# EasyEDA Pro project 数电课设-电子密码锁.eprj

# Schematic 密码电子锁

## Sheets
1 按键输入模块: Create Date: 2022-10-20; Page Name: 按键输入模块; Project Name: 数电课设-电子密码锁; Schematic Name: 密码电子锁; Update Date: 2022-10-27; Company: 广东工业大学; Drawed: 陈宇杰; Page Size: A4; Version: V1.0
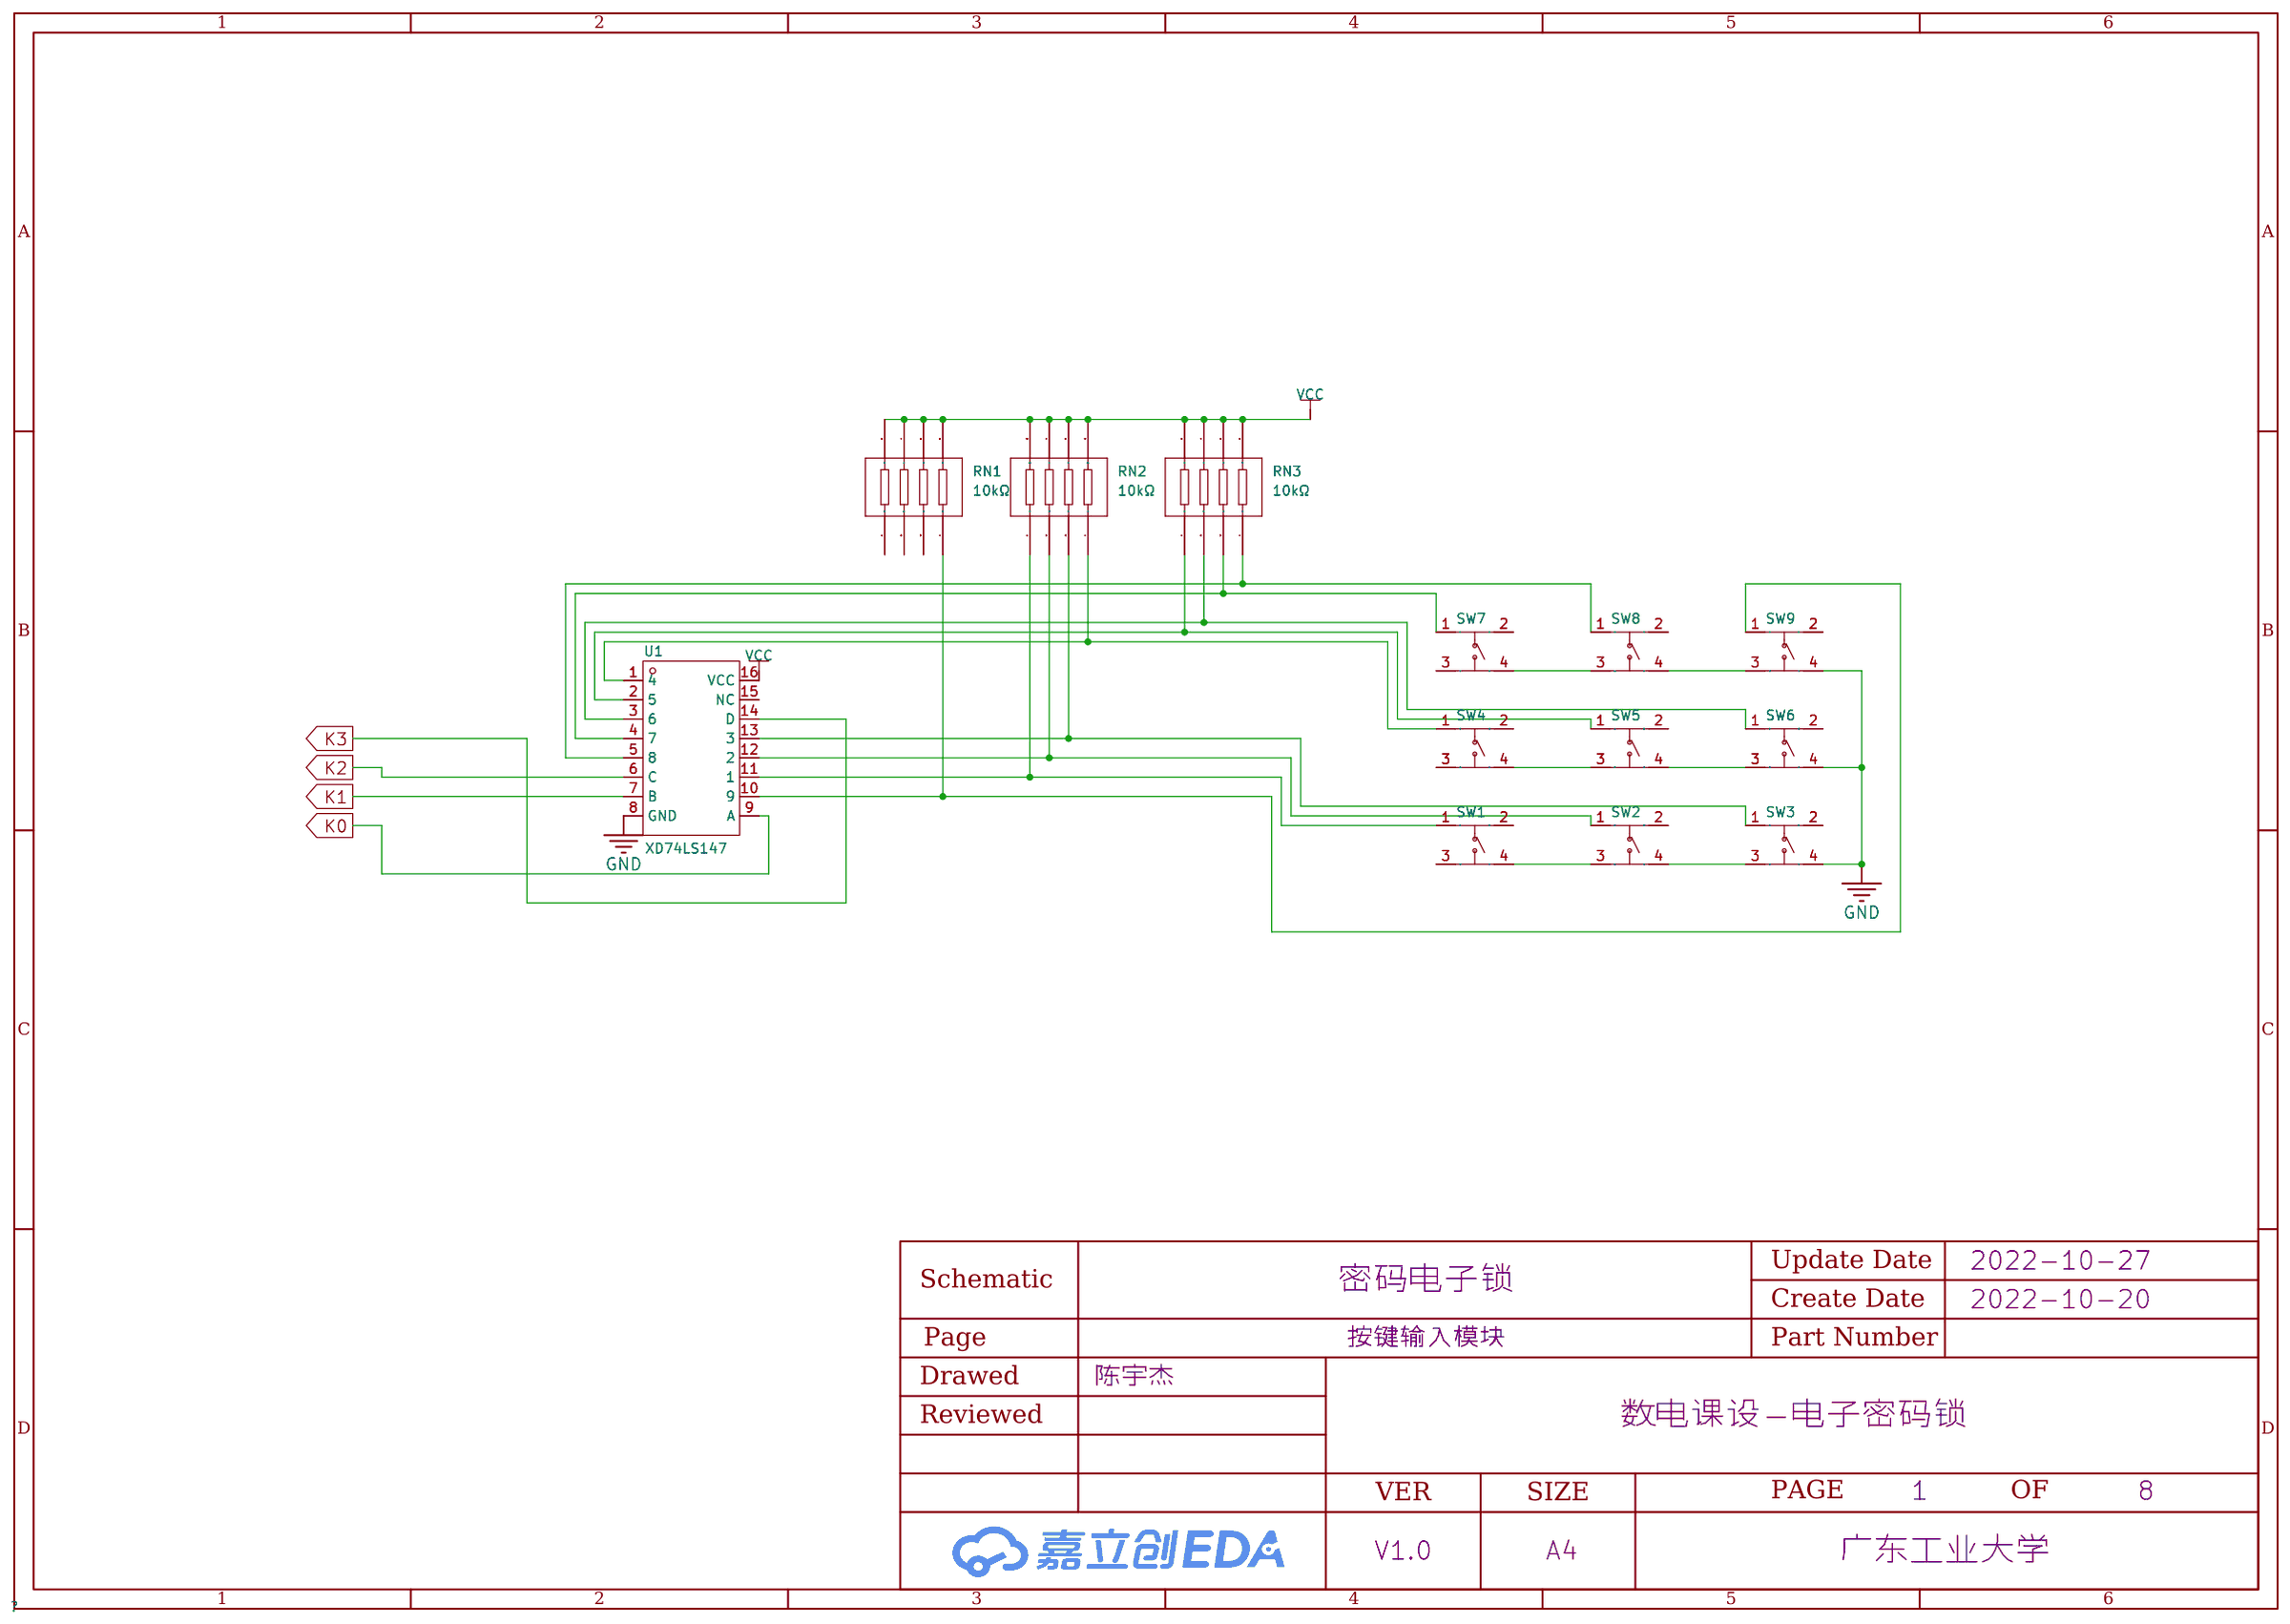
[diagram p0: 按键输入模块]
2 模式选择模块: Page Name: 模式选择模块; Update Date: 2022-10-21
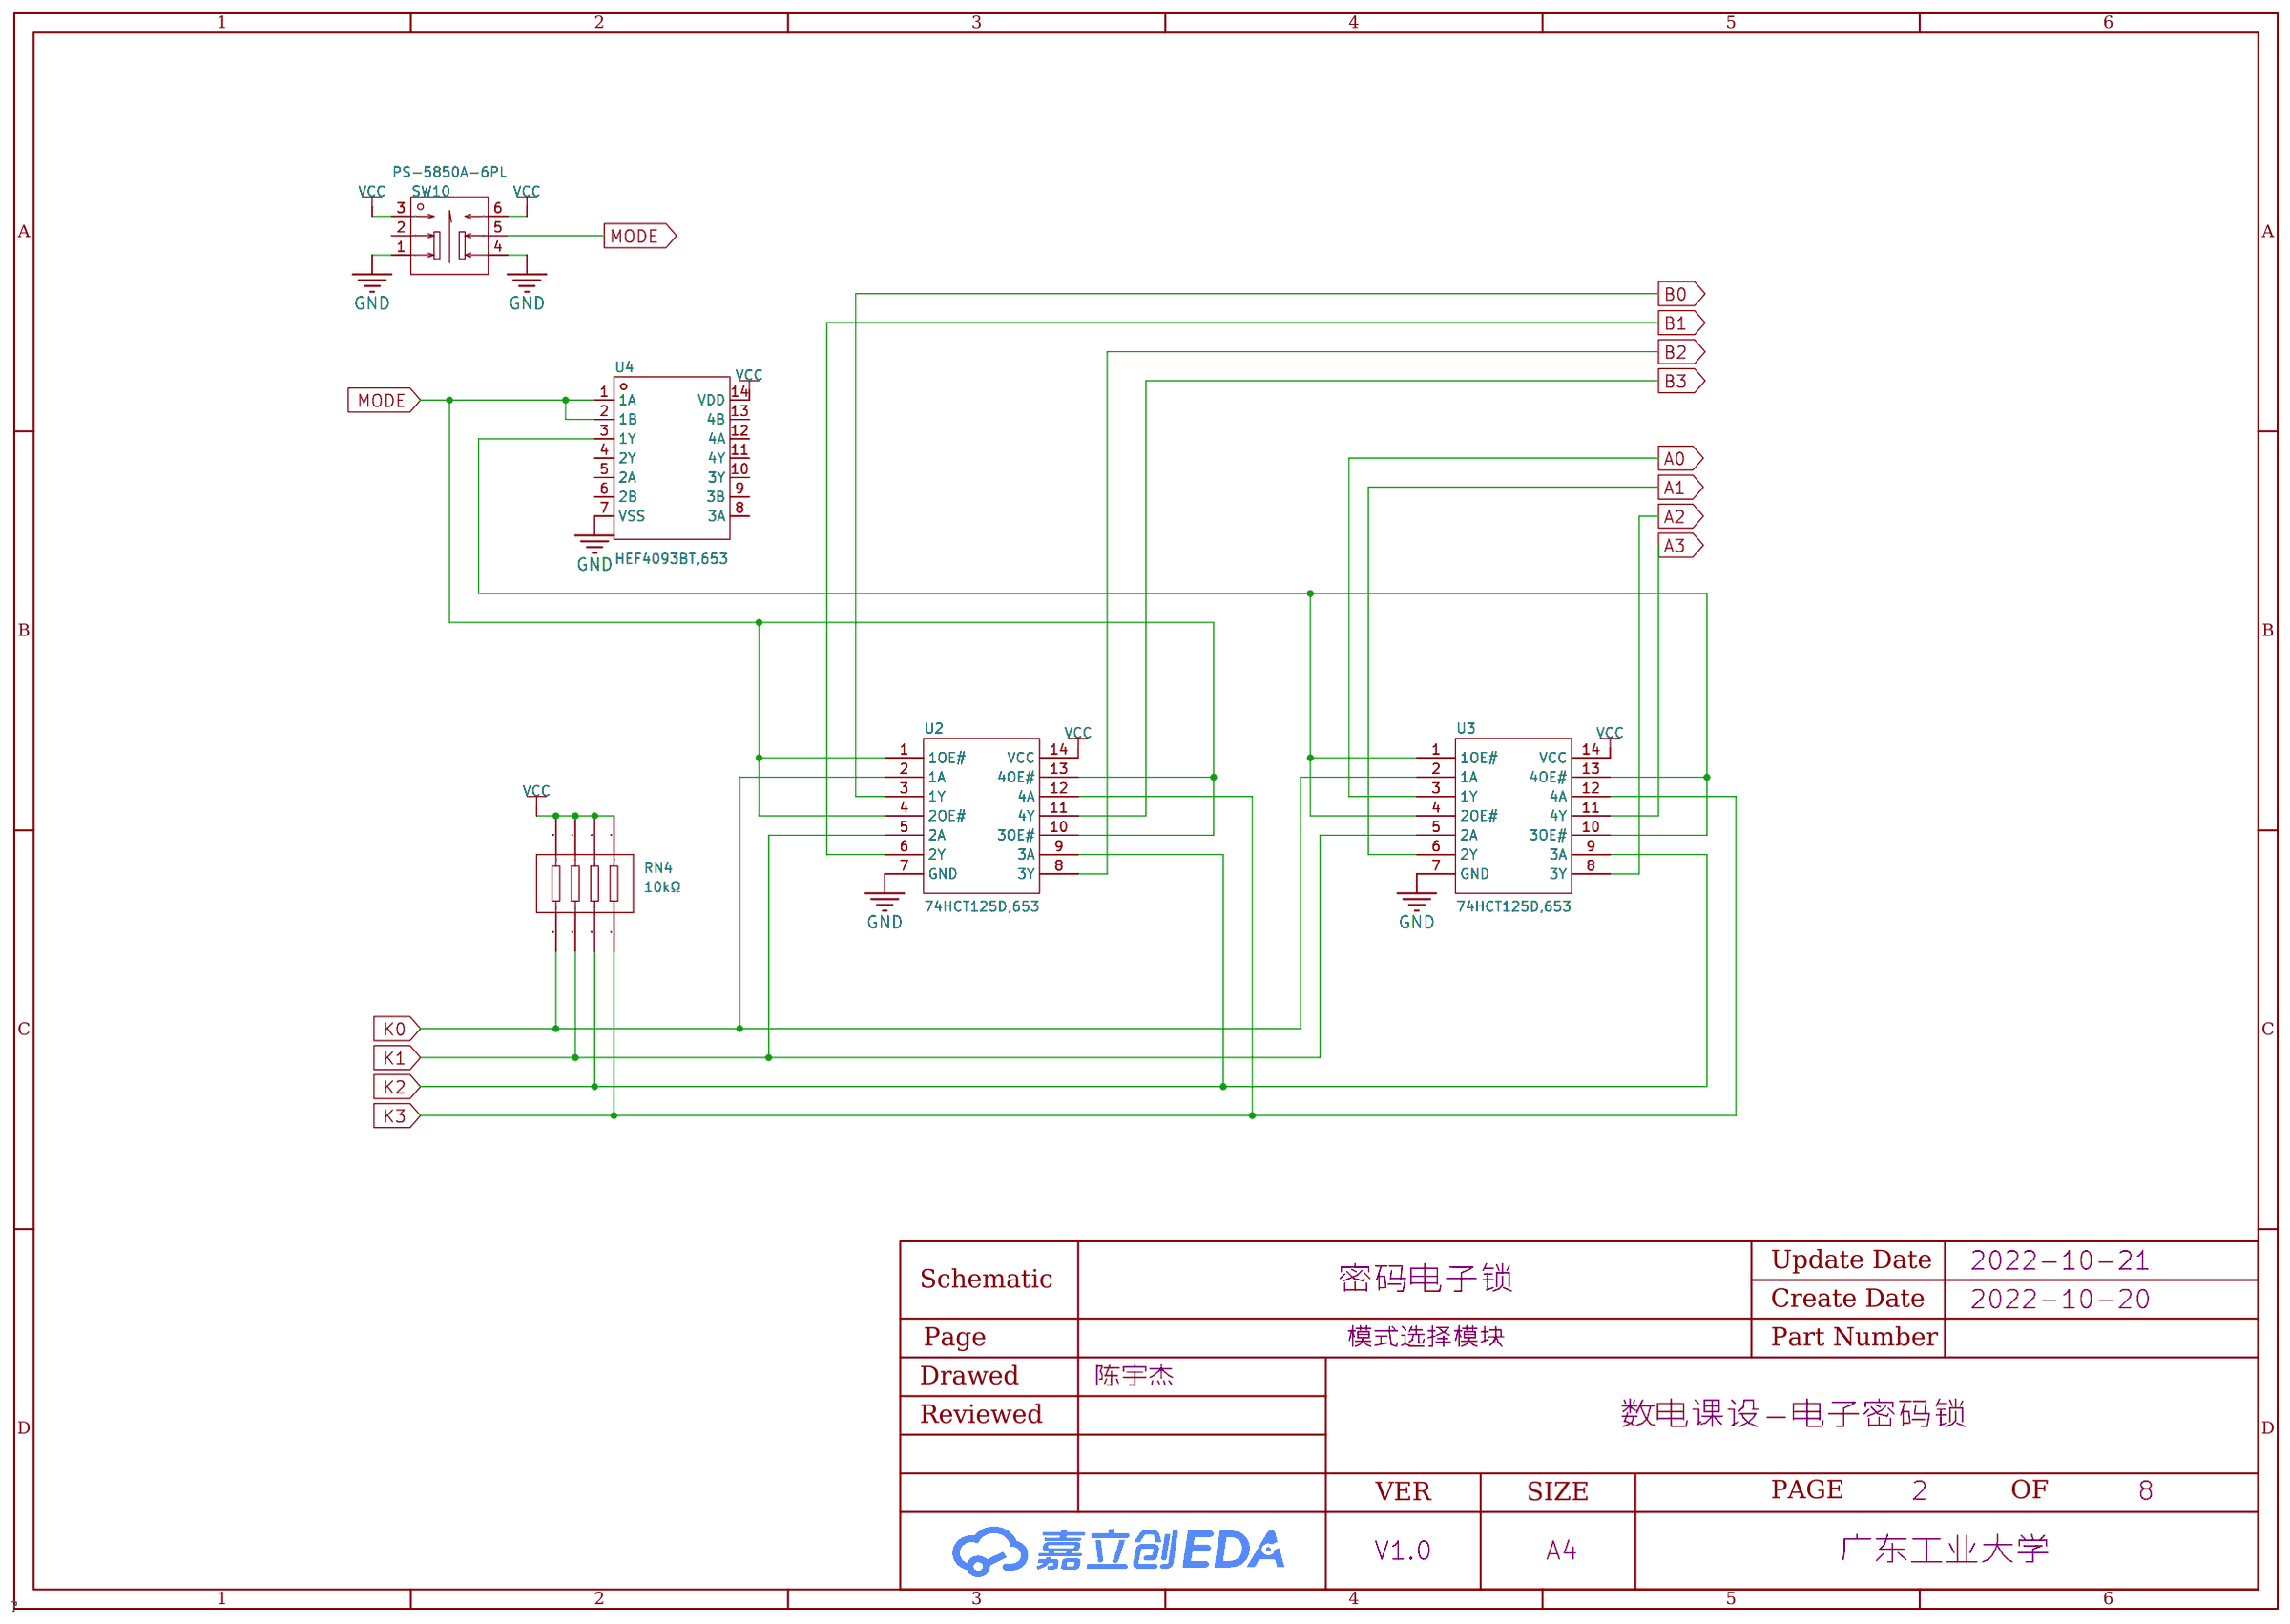
[diagram p1: 模式选择模块]
3 密码保存模块: Page Name: 密码保存模块; Update Date: 2022-10-21
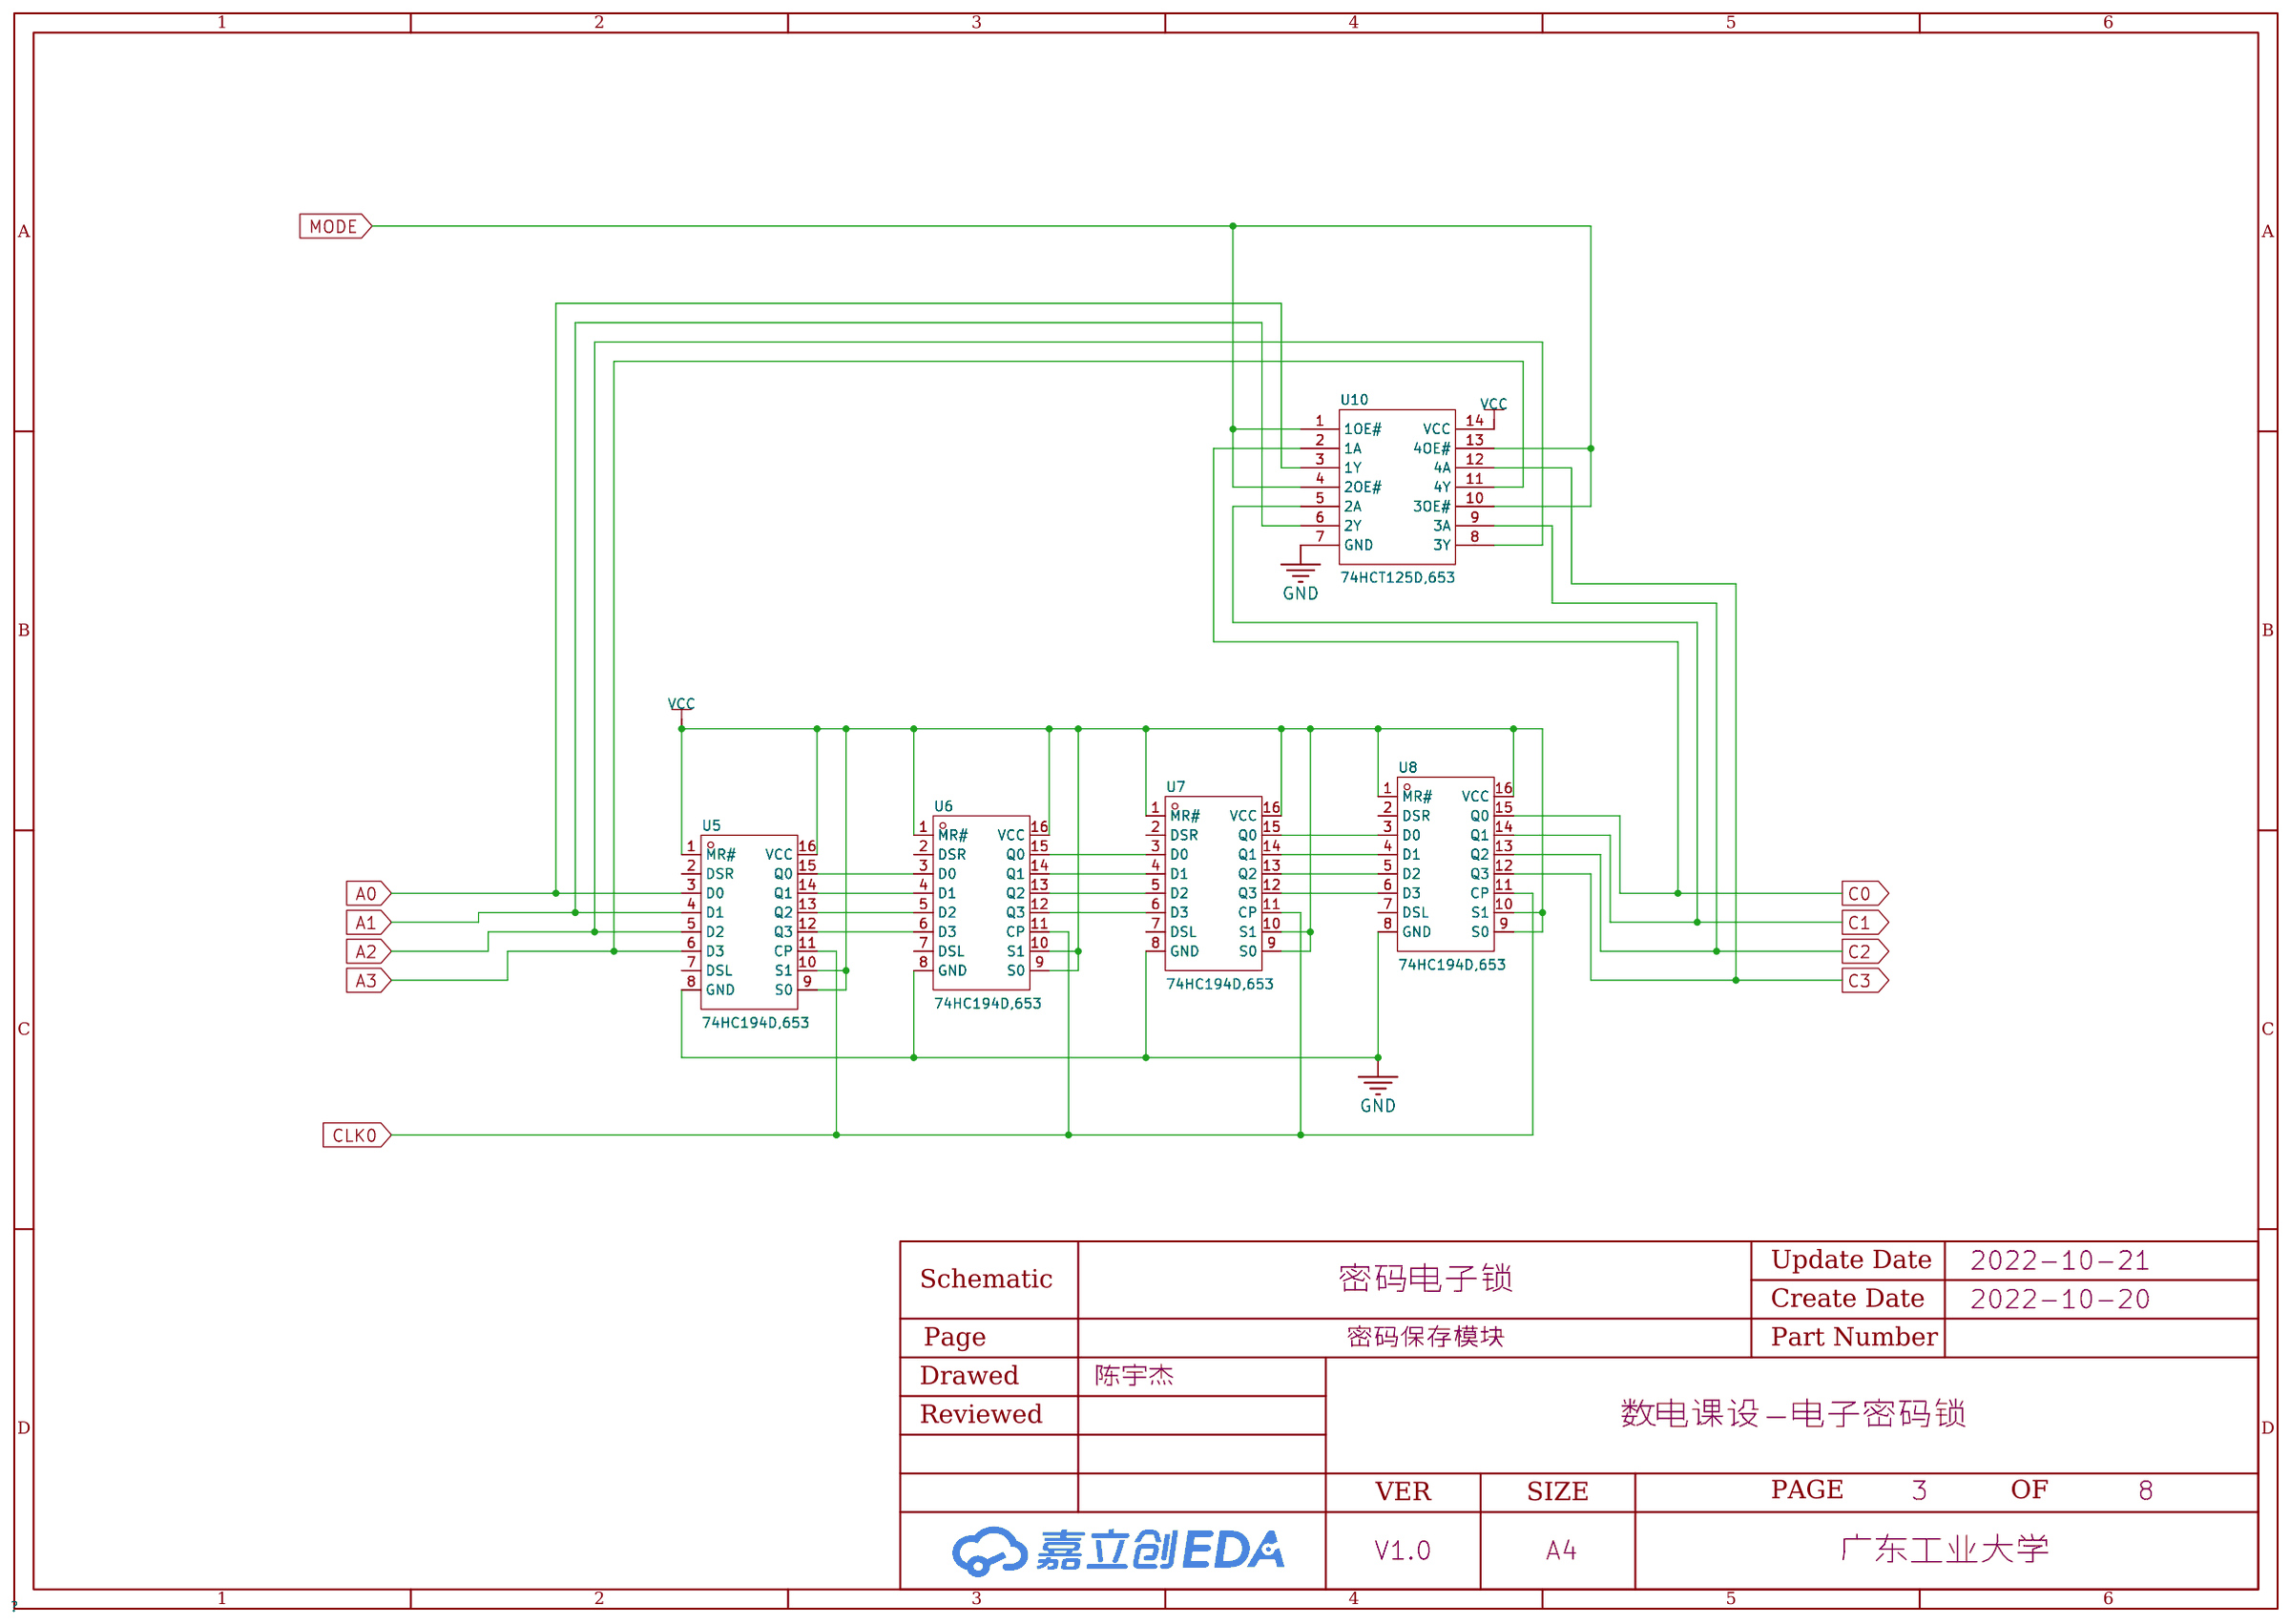
[diagram p2: 密码保存模块]
4 数字比较模块: Page Name: 数字比较模块; Update Date: 2022-10-21
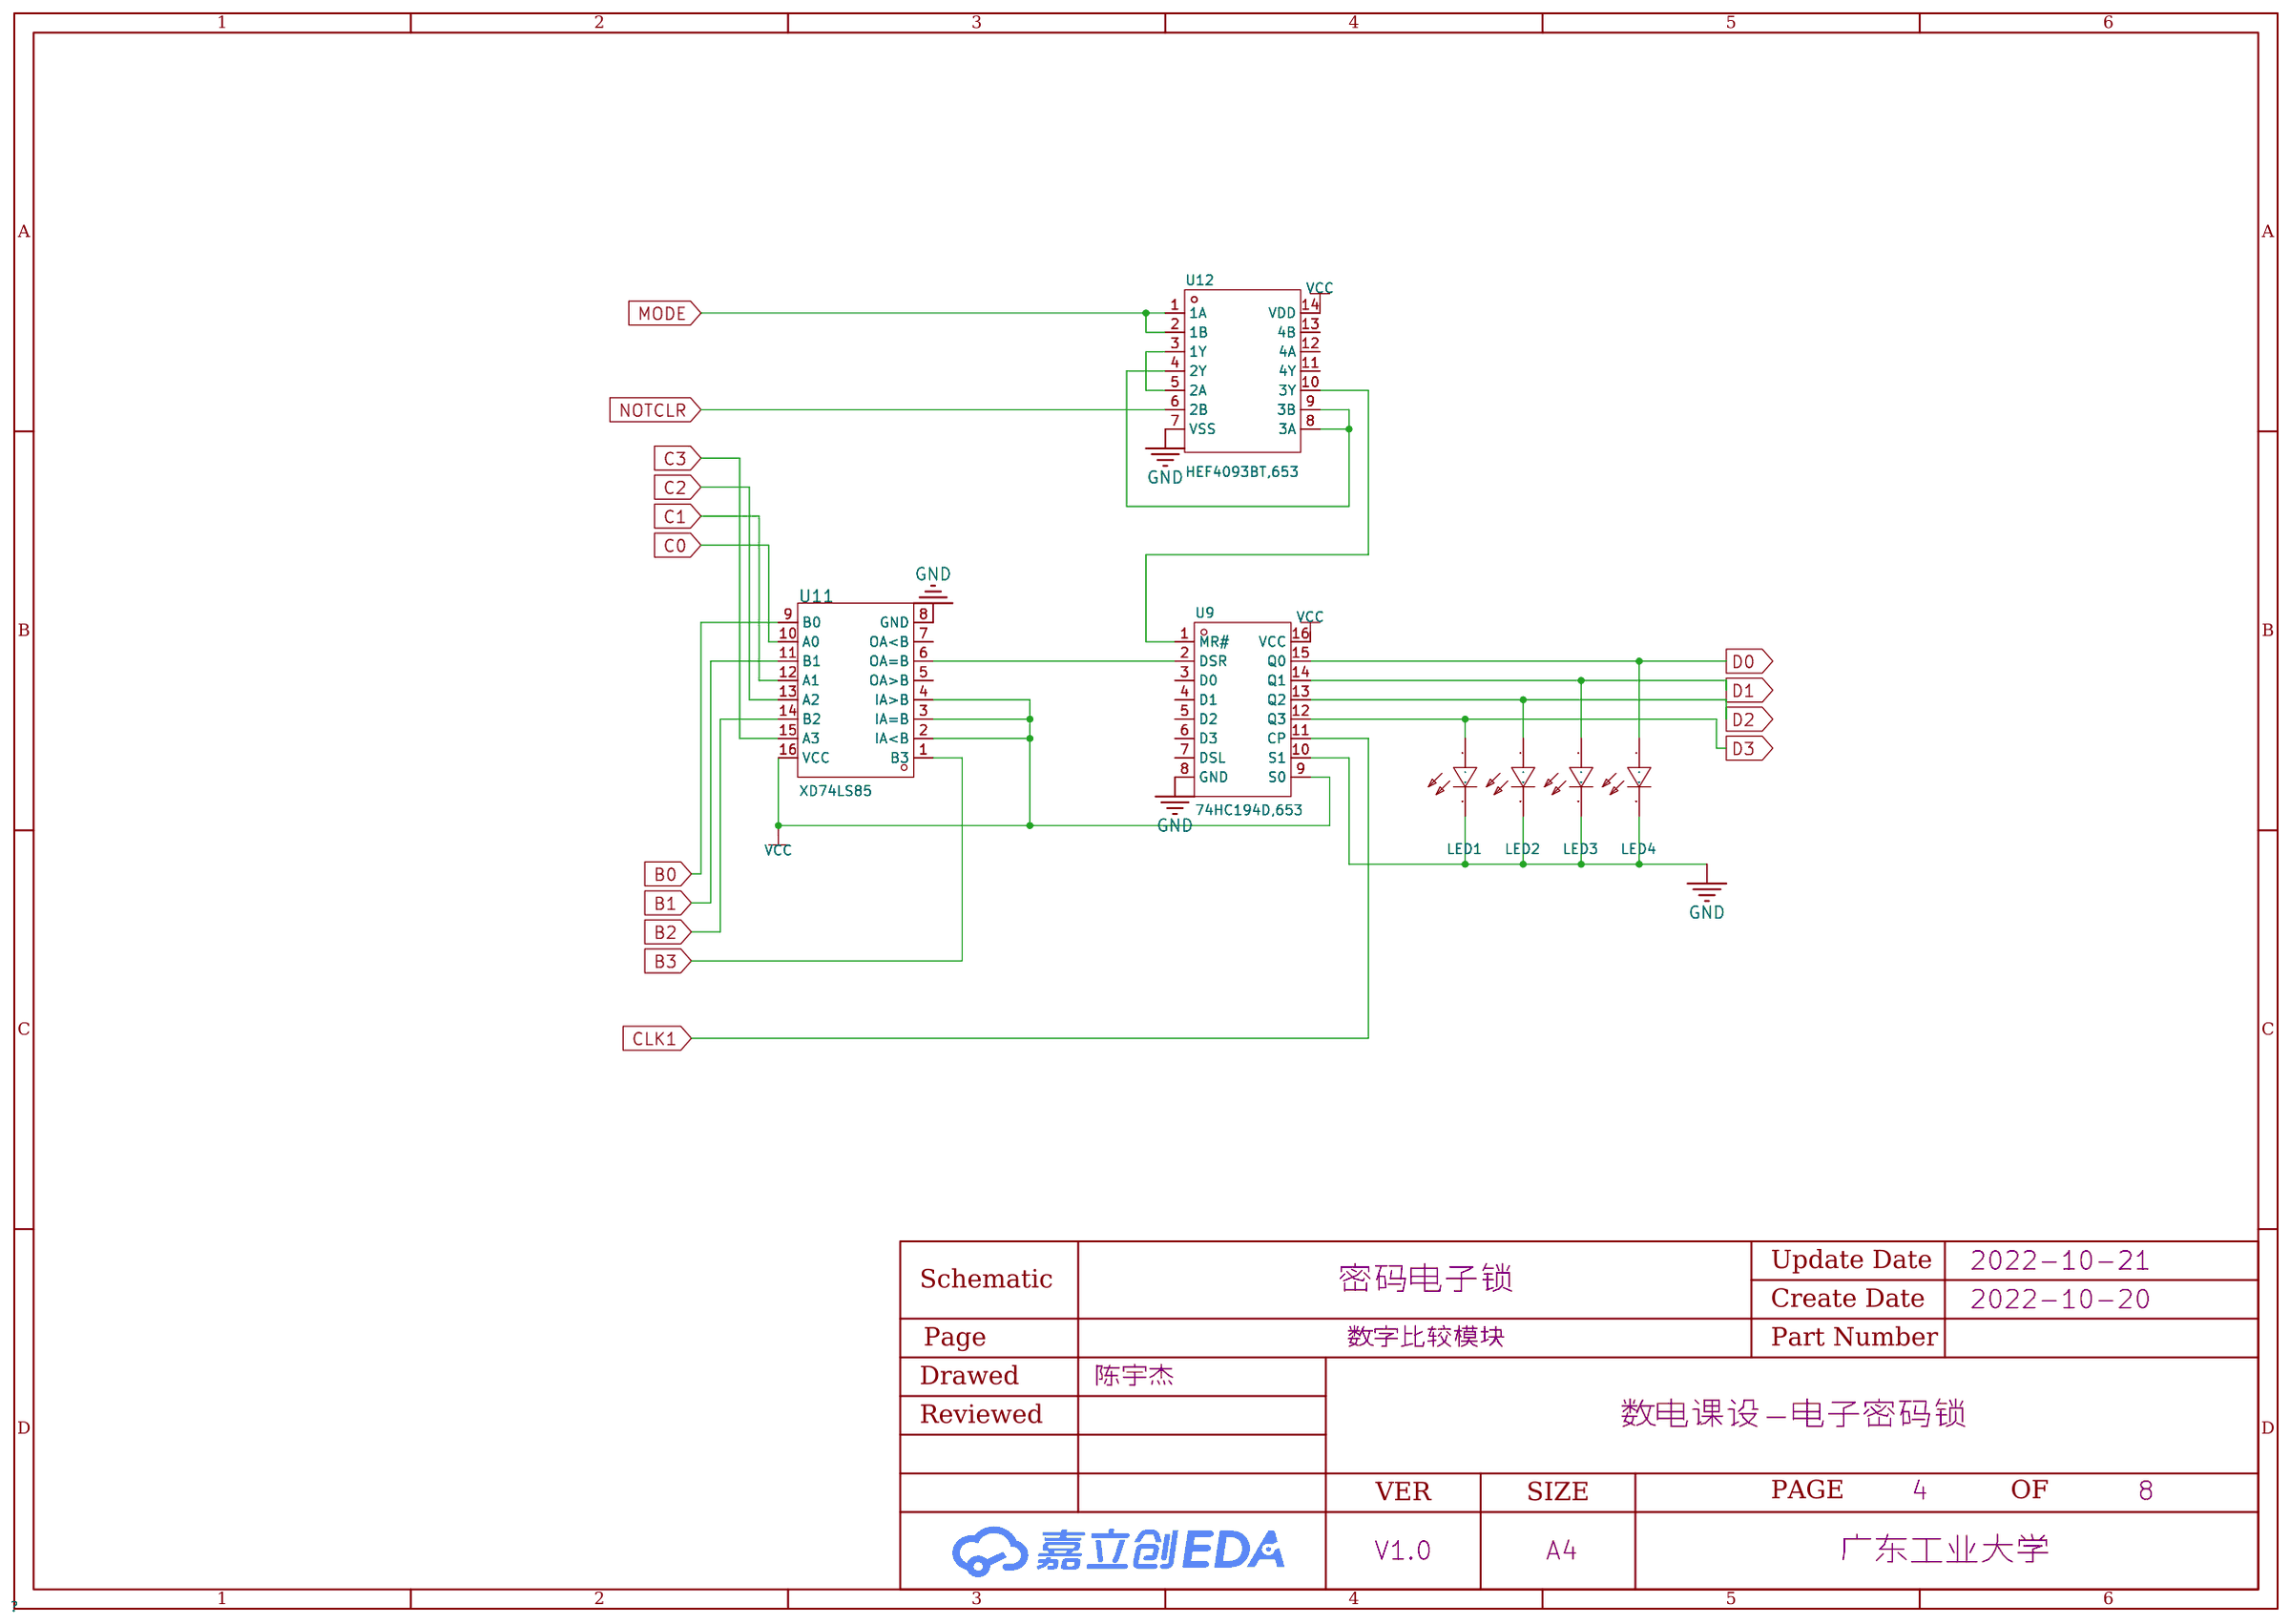
[diagram p3: 数字比较模块]
5 解锁信号模块: Page Name: 解锁信号模块; Update Date: 2022-10-21
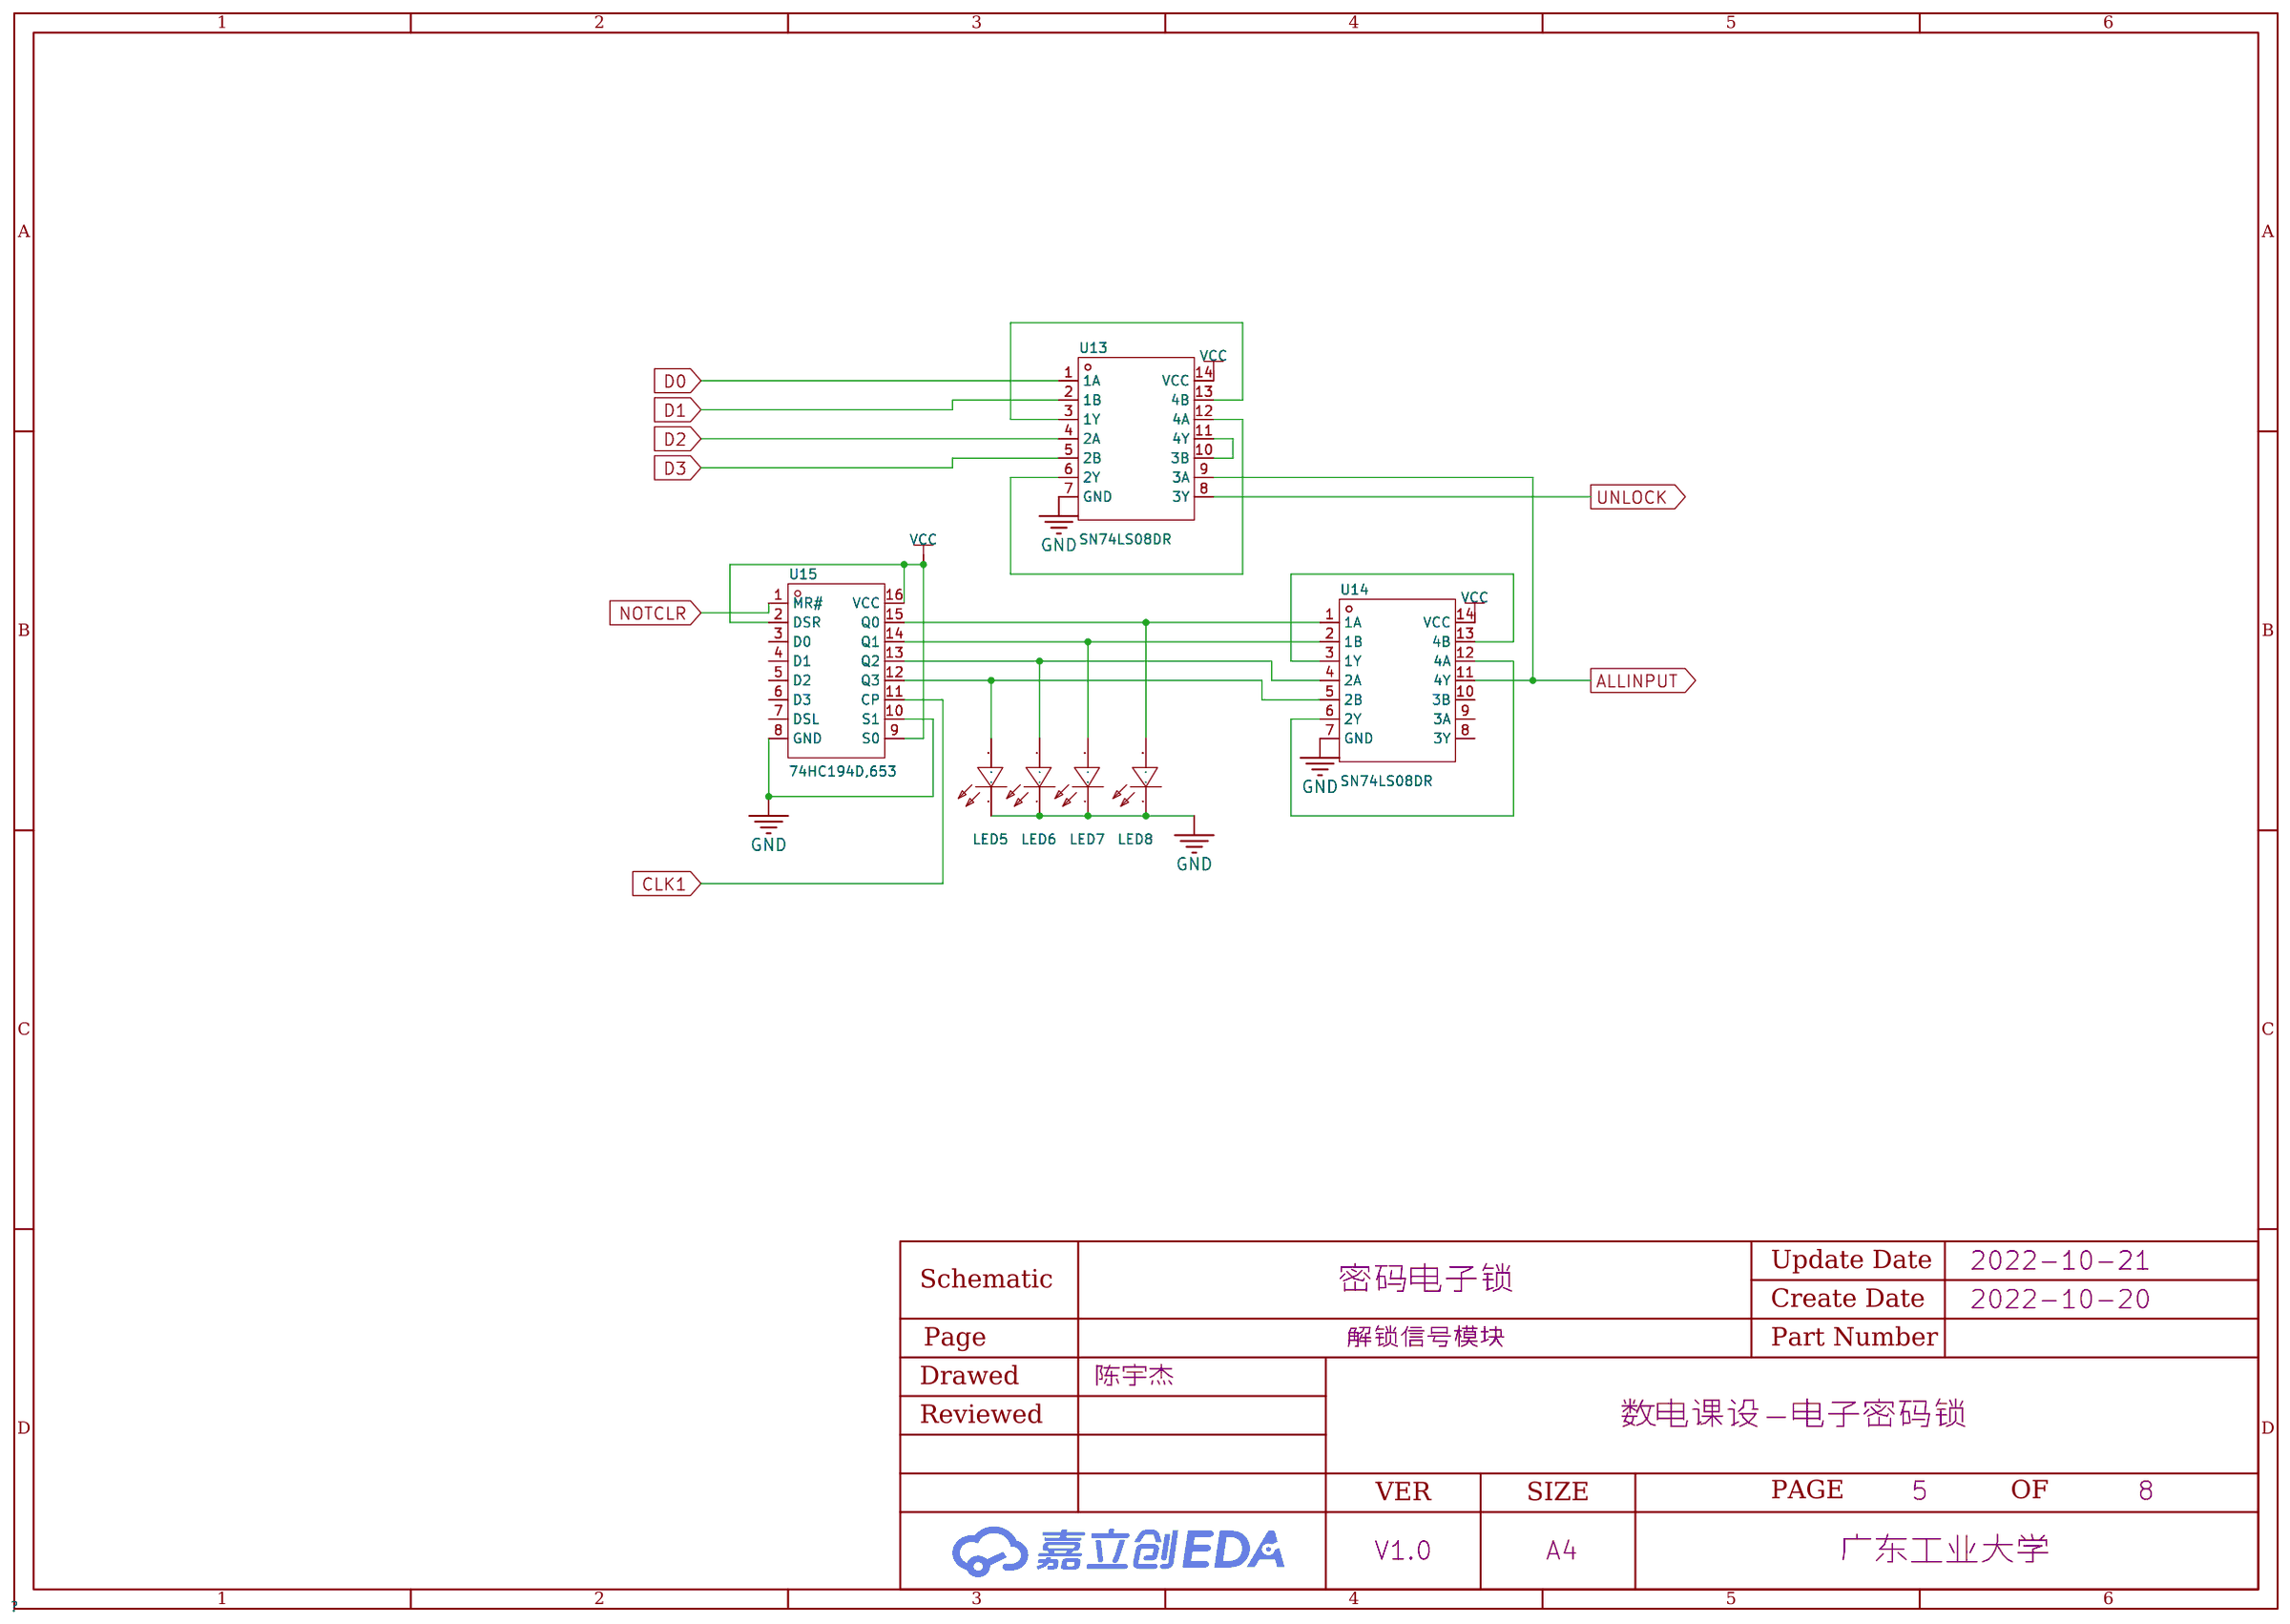
[diagram p4: 解锁信号模块]
6 信号输出模块: Page Name: 信号输出模块; Update Date: 2022-10-21
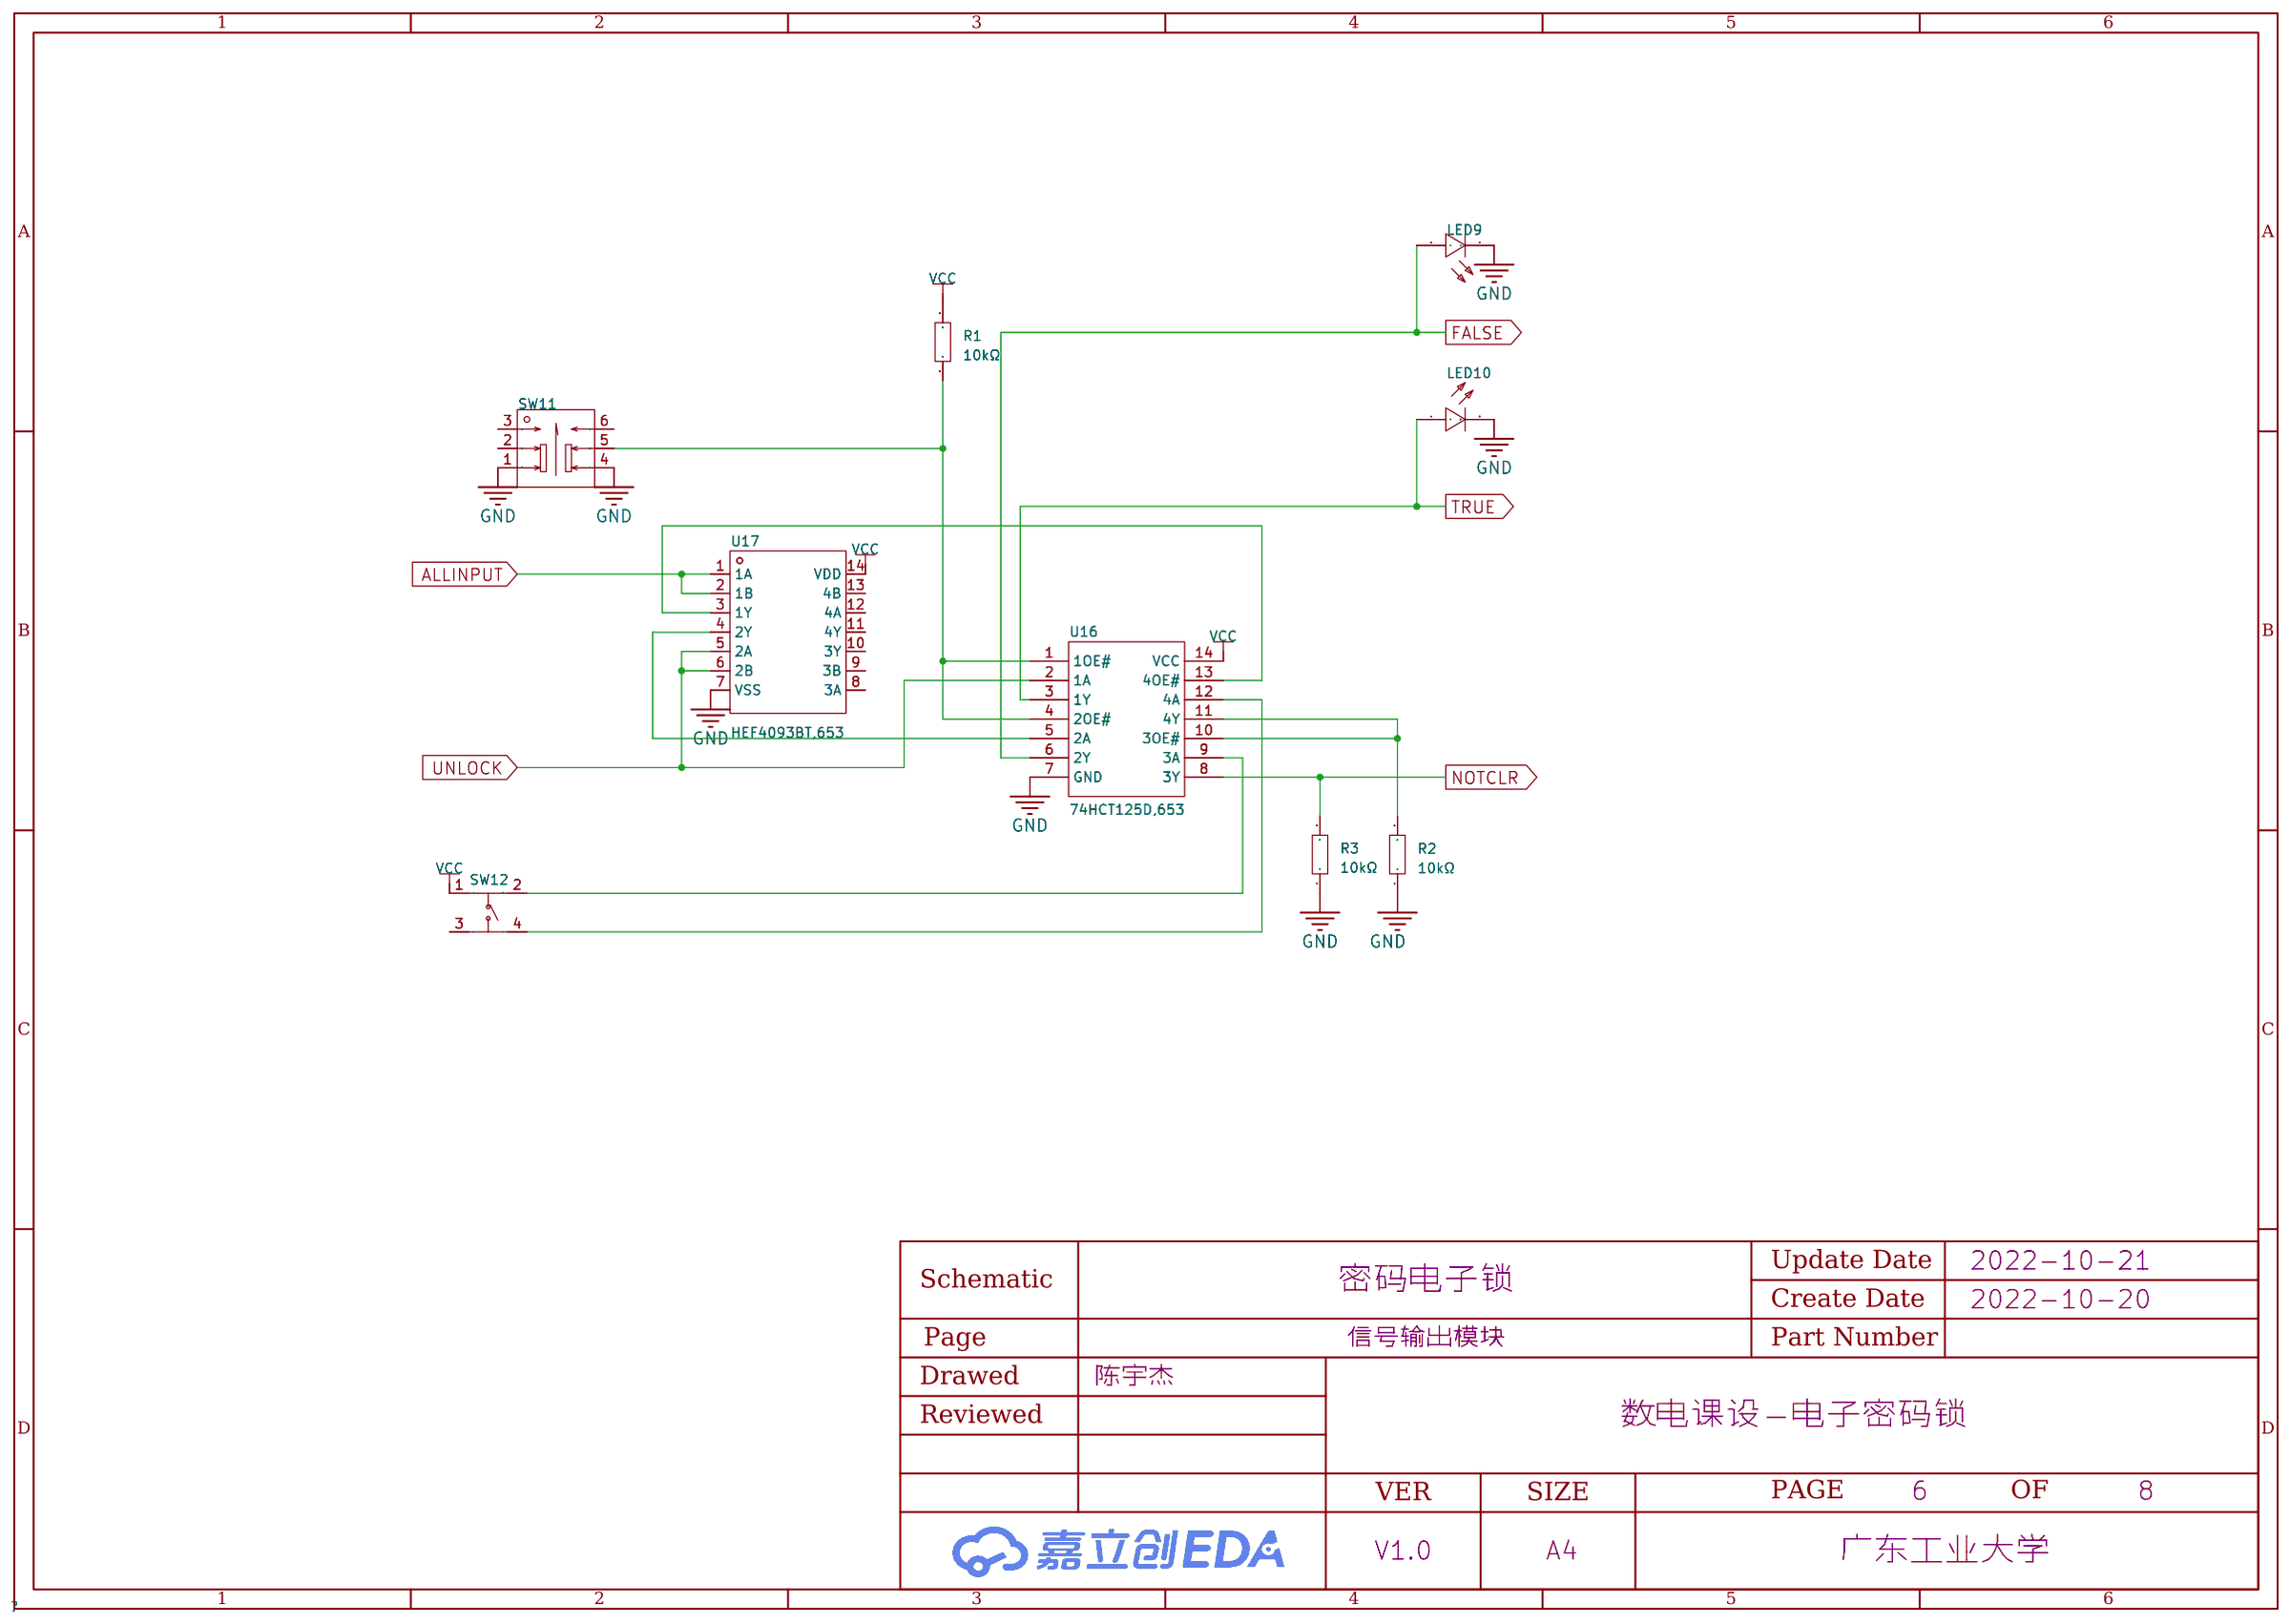
[diagram p5: 信号输出模块]
7 时钟信号模块: Page Name: 时钟信号模块; Update Date: 2022-10-26
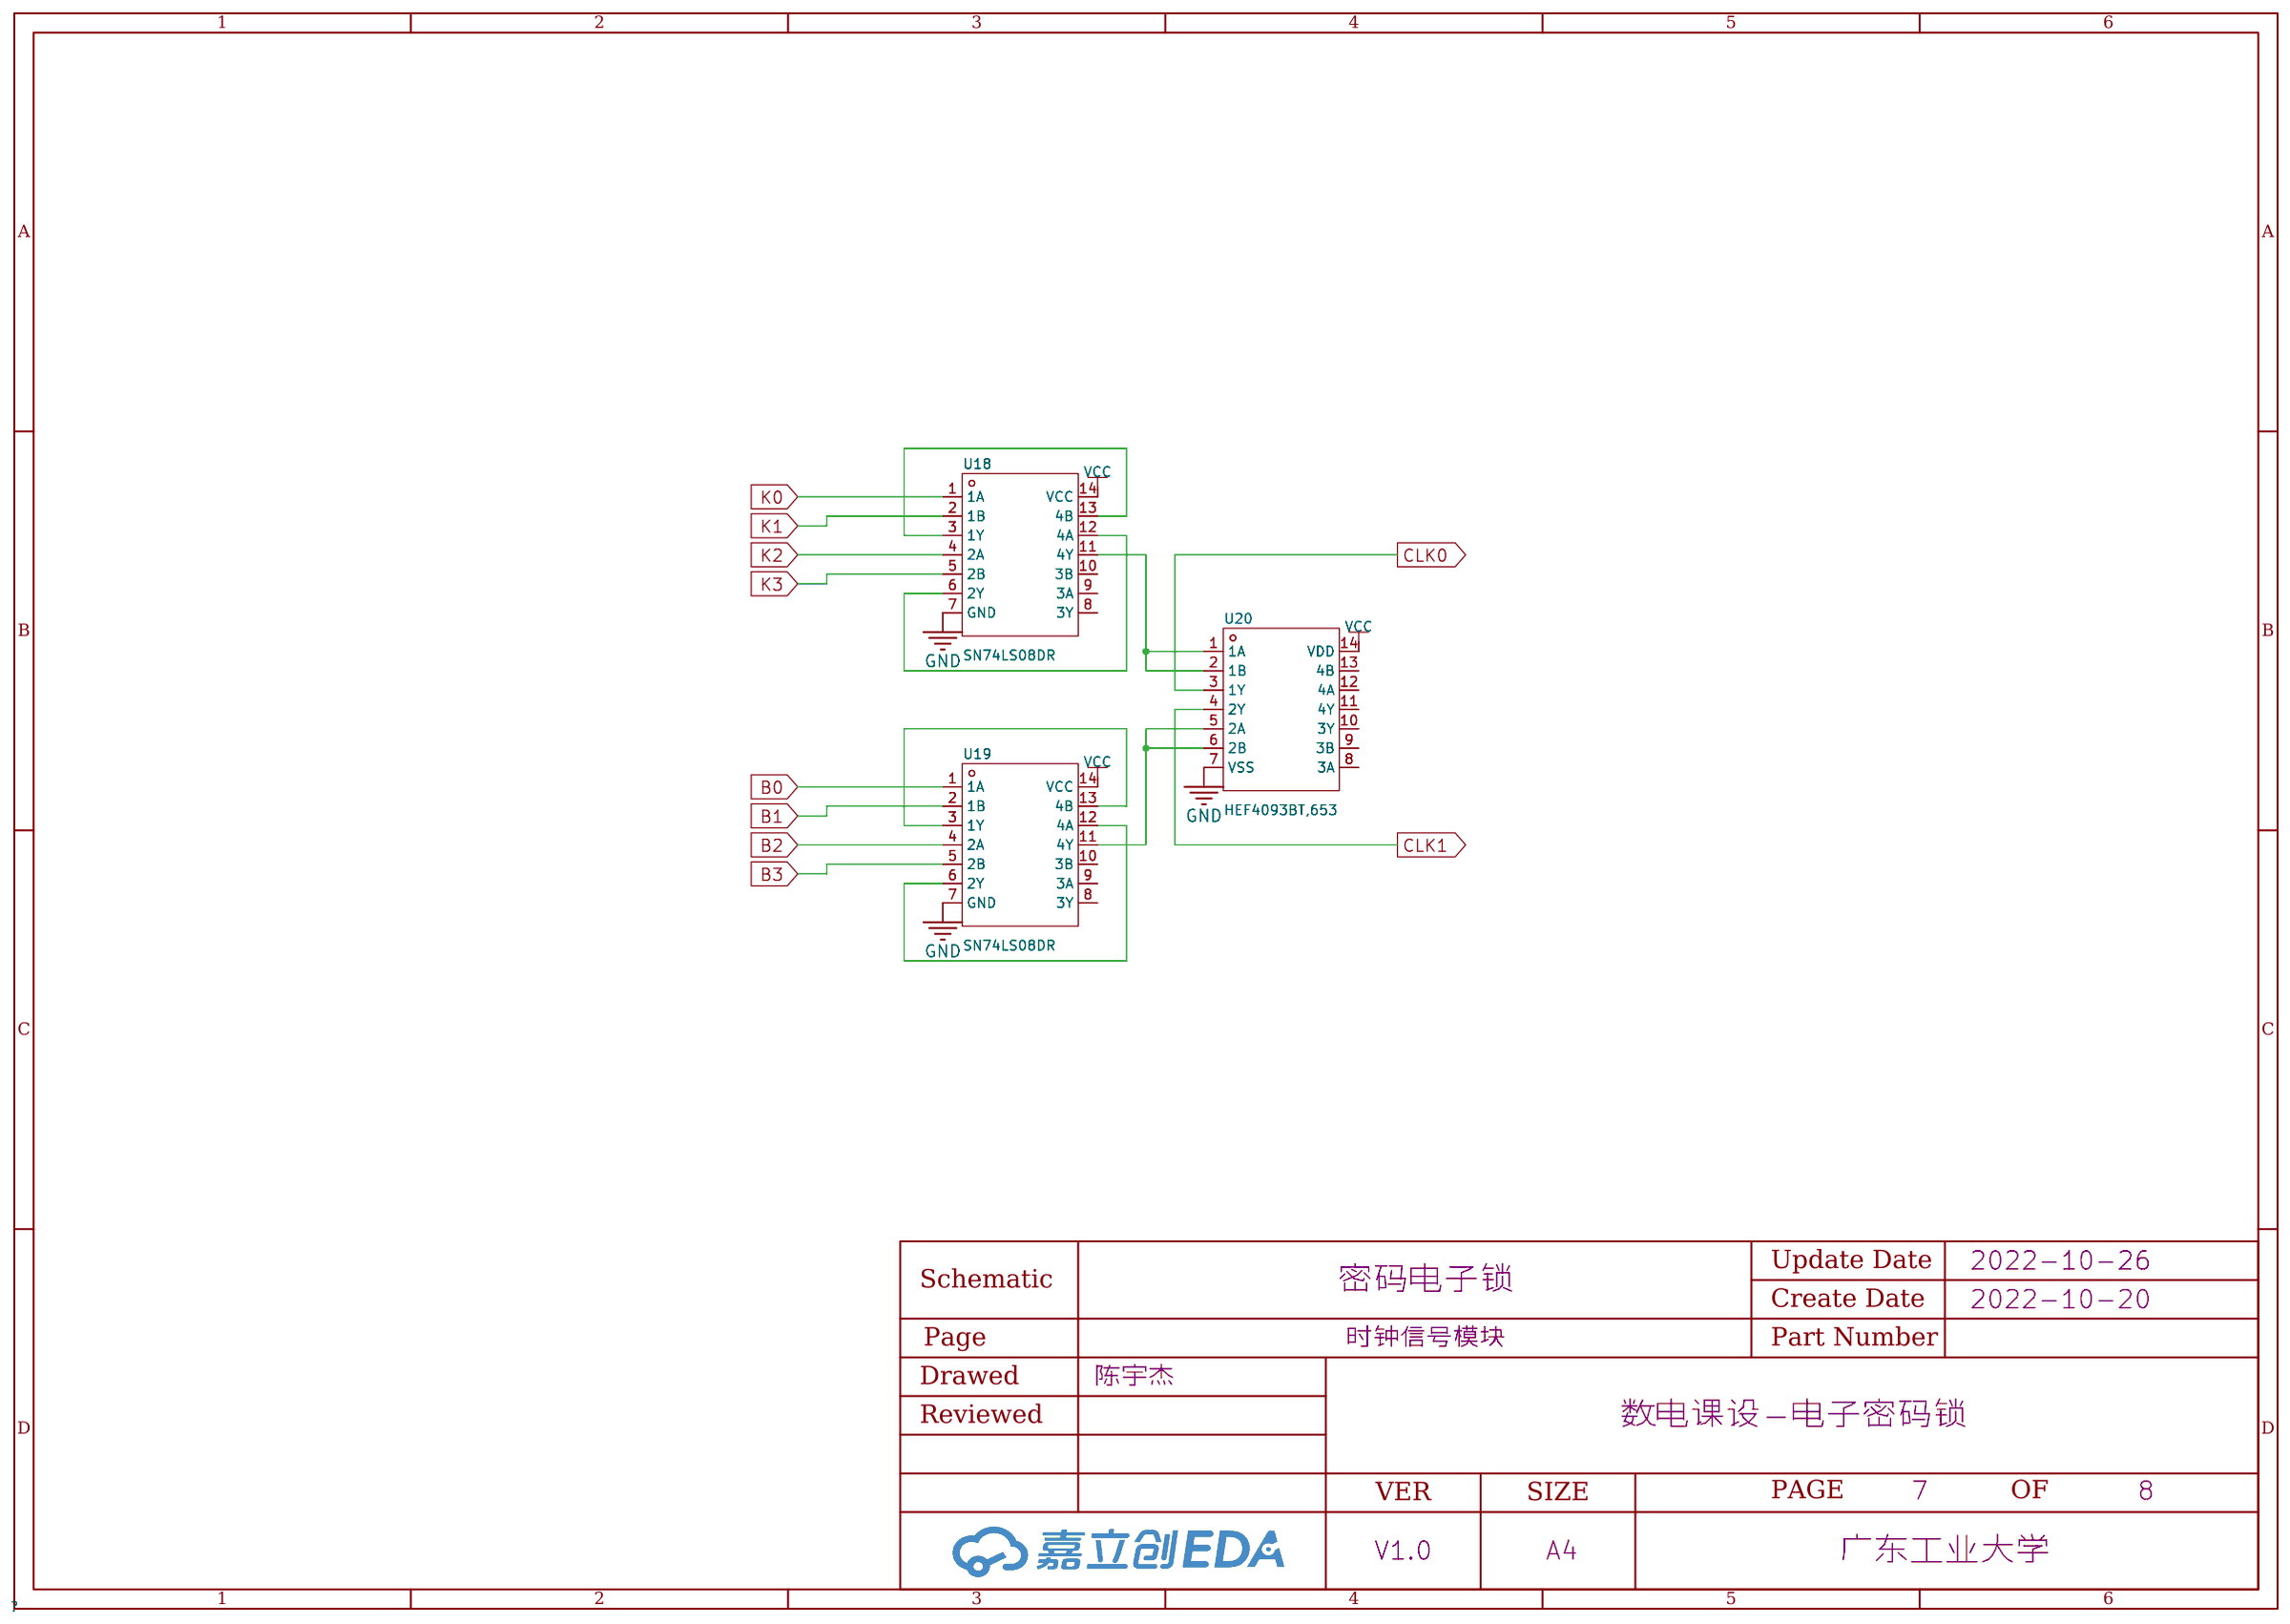
[diagram p6: 时钟信号模块]
8 对外端口模块: Create Date: 2022-10-21; Page Name: 对外端口模块; Update Date: 2022-10-21
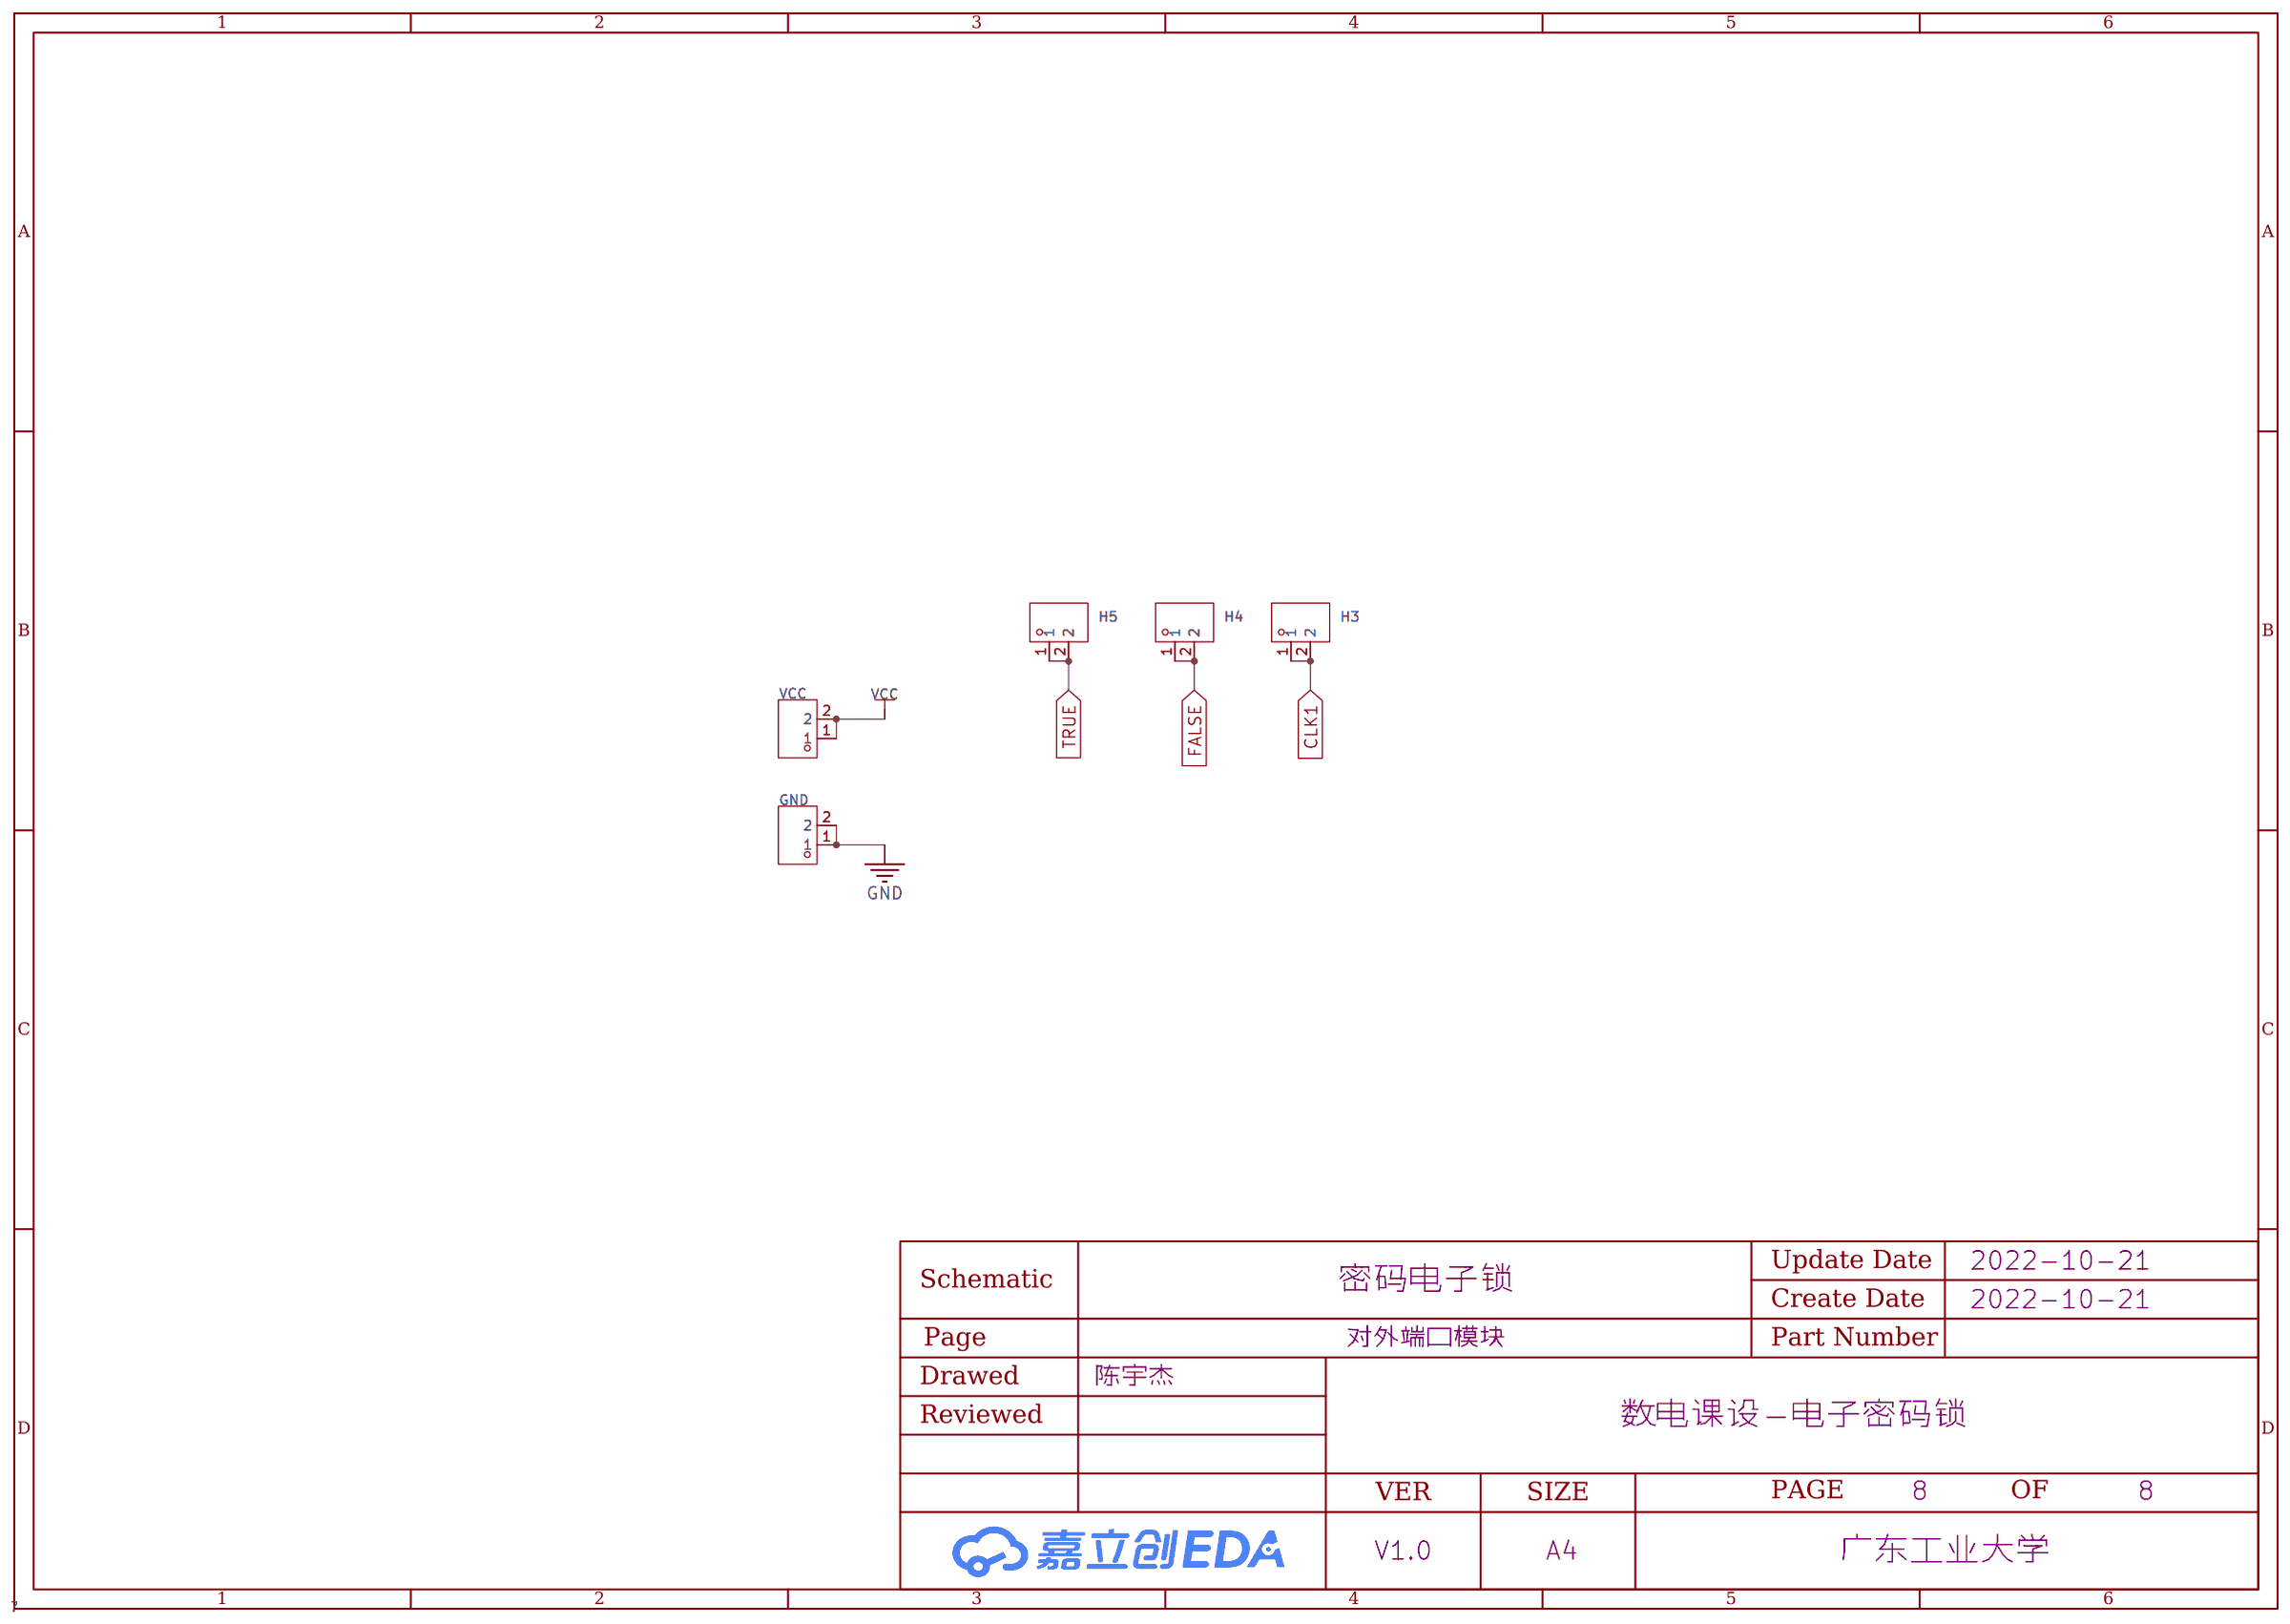
[diagram p7: 对外端口模块]

## Parts
sheet 信号输出模块
LED9  NCD0603R1  [LED0603-RD_RED]
LED10  19-217/GHC-YR1S2/3T  [LED0603-R-RD]
R1  10kΩ  [R0603]
R2  10kΩ  [R0603]
R3  10kΩ  [R0603]
SW11  PS-5850A-6PL  [SW-TH_6P-L5.8-W5.8-P2.00-LS4.5-BL]
SW12  KH-6X6X5H-STM  [SW-SMD_4P-L6.0-W6.0-P4.50-LS9.0-2]
U16  74HCT125D,653  [SOIC-14_L8.7-W3.9-P1.27-LS6.0-BL]
U17  HEF4093BT,653  [SOIC-14_L8.7-W3.9-P1.27-LS6.0-BL]
sheet 密码保存模块
U5  74HC194D,653  [SO-16_L9.9-W3.9-P1.27-LS6.0-BL]
U6  74HC194D,653  [SO-16_L9.9-W3.9-P1.27-LS6.0-BL]
U7  74HC194D,653  [SO-16_L9.9-W3.9-P1.27-LS6.0-BL]
U8  74HC194D,653  [SO-16_L9.9-W3.9-P1.27-LS6.0-BL]
U10  74HCT125D,653  [SOIC-14_L8.7-W3.9-P1.27-LS6.0-BL]
sheet 对外端口模块
GND  PZ254V-11-02P  [HDR-TH_2P-P2.54-V-M]
H3  PZ254V-11-02P  [HDR-TH_2P-P2.54-V-M]
H4  PZ254V-11-02P  [HDR-TH_2P-P2.54-V-M]
H5  PZ254V-11-02P  [HDR-TH_2P-P2.54-V-M]
VCC  PZ254V-11-02P  [HDR-TH_2P-P2.54-V-M]
sheet 按键输入模块
RN1  10kΩ  [RES-ARRAY-SMD_0603-8P-L3.2-W1.6-BL]
RN2  10kΩ  [RES-ARRAY-SMD_0603-8P-L3.2-W1.6-BL]
RN3  10kΩ  [RES-ARRAY-SMD_0603-8P-L3.2-W1.6-BL]
SW1  KH-6X6X5H-STM  [SW-SMD_4P-L6.0-W6.0-P4.50-LS9.0-2]
SW2  KH-6X6X5H-STM  [SW-SMD_4P-L6.0-W6.0-P4.50-LS9.0-2]
SW3  KH-6X6X5H-STM  [SW-SMD_4P-L6.0-W6.0-P4.50-LS9.0-2]
SW4  KH-6X6X5H-STM  [SW-SMD_4P-L6.0-W6.0-P4.50-LS9.0-2]
SW5  KH-6X6X5H-STM  [SW-SMD_4P-L6.0-W6.0-P4.50-LS9.0-2]
SW6  KH-6X6X5H-STM  [SW-SMD_4P-L6.0-W6.0-P4.50-LS9.0-2]
SW7  KH-6X6X5H-STM  [SW-SMD_4P-L6.0-W6.0-P4.50-LS9.0-2]
SW8  KH-6X6X5H-STM  [SW-SMD_4P-L6.0-W6.0-P4.50-LS9.0-2]
SW9  KH-6X6X5H-STM  [SW-SMD_4P-L6.0-W6.0-P4.50-LS9.0-2]
U1  XD74LS147  [DIP-16_L19.2-W6.6-P2.54-LS7.6-BL]
sheet 数字比较模块
LED1  19-217/BHC-ZL1M2RY/3T  [LED0603-R-RD_BLUE]
LED2  19-217/BHC-ZL1M2RY/3T  [LED0603-R-RD_BLUE]
LED3  19-217/BHC-ZL1M2RY/3T  [LED0603-R-RD_BLUE]
LED4  19-217/BHC-ZL1M2RY/3T  [LED0603-R-RD_BLUE]
U9  74HC194D,653  [SO-16_L9.9-W3.9-P1.27-LS6.0-BL]
U11  XD74LS85  [PDIP-16_L19.2-W6.6-P2.54-LS7.62-BL]
U12  HEF4093BT,653  [SOIC-14_L8.7-W3.9-P1.27-LS6.0-BL]
sheet 时钟信号模块
U18  SN74LS08DR  [SOIC-14_L8.7-W3.9-P1.27-LS6.0-BL]
U19  SN74LS08DR  [SOIC-14_L8.7-W3.9-P1.27-LS6.0-BL]
U20  HEF4093BT,653  [SOIC-14_L8.7-W3.9-P1.27-LS6.0-BL]
sheet 模式选择模块
RN4  10kΩ  [RES-ARRAY-SMD_0603-8P-L3.2-W1.6-BL]
SW10  PS-5850A-6PL  [SW-TH_6P-L5.8-W5.8-P2.00-LS4.5-BL]
U2  74HCT125D,653  [SOIC-14_L8.7-W3.9-P1.27-LS6.0-BL]
U3  74HCT125D,653  [SOIC-14_L8.7-W3.9-P1.27-LS6.0-BL]
U4  HEF4093BT,653  [SOIC-14_L8.7-W3.9-P1.27-LS6.0-BL]
sheet 解锁信号模块
LED5  17-21SYGC/S530-E3/TR8  [LED0805-RD]
LED6  17-21SYGC/S530-E3/TR8  [LED0805-RD]
LED7  17-21SYGC/S530-E3/TR8  [LED0805-RD]
LED8  17-21SYGC/S530-E3/TR8  [LED0805-RD]
U13  SN74LS08DR  [SOIC-14_L8.7-W3.9-P1.27-LS6.0-BL]
U14  SN74LS08DR  [SOIC-14_L8.7-W3.9-P1.27-LS6.0-BL]
U15  74HC194D,653  [SO-16_L9.9-W3.9-P1.27-LS6.0-BL]

## Library data of the parts
LED9 = NCD0603R1_C84263: 发光颜色:红灯;; LCSC Part Name: 红灯; Supplier Part: C84263; Manufacturer: 国星光电; Supplier Footprint: 0603; JLCPCB Part Class: Extended Part; Datasheet: https://atta.szlcsc.com/upload/public/pdf/source/20200820/C84263_DABC6A75E58F576973B407FDBA283D60.pdf; Supplier: LCSC; Emitted Color: 红灯
LED10 = 19-217/GHC-YR1S2/3T: 照明颜色:翠绿;色温 - CCT（K）:-;主波长/色坐标:520~535nm;; LCSC Part Name: 翠绿LED; Supplier Part: C72043; Manufacturer: EVERLIGHT(台湾亿光); Supplier Footprint: 0603; JLCPCB Part Class: Basic Part; Datasheet: https://atta.szlcsc.com/upload/public/pdf/source/20160507/1462613613780.pdf; Supplier: LCSC; Mounting Type: 表面贴装; Illumination Color: 翠绿; Luminous Intensity (IF=20mA): 112~258mcd; Dominant Wavelength / Coordinate rank: 520~535nm
R1-R3 = 0603WAF1002T5E: 电阻类型:厚膜电阻;阻值:10kΩ;精度:±1%;功率:100mW;温度系数:±100ppm/;最大工作电压:75V;工作温度范围:-55~+155;; LCSC Part Name: 10kΩ ±1% 100mW; Supplier Part: C25804; Manufacturer: UNI-ROYAL(厚声); Supplier Footprint: 0603; JLCPCB Part Class: Basic Part; Datasheet: https://atta.szlcsc.com/upload/public/pdf/source/20200306/C422600_1E6D84923E4A46A82E41ADD87F860B5C.pdf; Supplier: LCSC; Type: 厚膜电阻; Tolerance: ±1%; Power(Watts): 100mW; Temperature Coefficient: ±100ppm/; Overload Voltage (Max): 75V; Operating Temperature Range: -55~+155
SW10 SW11 = PS-5850A-6PL: 5.8自锁按键开关 高头 耐高温; LCSC Part Name: 自锁按键开关; Supplier Part: C963201; Manufacturer: G-Switch(品赞); Supplier Footprint: 插件,5.8x5.8x10mm; JLCPCB Part Class: Extended Part; Datasheet: https://atta.szlcsc.com/upload/public/pdf/source/20201201/C963201_9229C247AC907A82E381B4EE0BC1DEDE.pdf; Supplier: LCSC
SW1-SW9 SW12 = KH-6X6X5H-STM: 触点电流:50mA;额定电压(DC):12V;电路结构:单刀单掷;安装方式:立贴;按钮形状:圆形按钮;按钮/盖帽颜色:黑色;机械寿命:80000;引脚样式:鸥翼型;开关长度:6mm;开关宽度:6mm;开关高度:5mm;带支架:否;; Supplier Part: C2837531; Manufacturer: kinghelm(金航标); Supplier Footprint: SMD; JLCPCB Part Class: Extended Part; Datasheet: https://atta.szlcsc.com/upload/public/pdf/source/20210608/C2837531_45E87AB996CE723B09405FF2EA209C4C.pdf; Supplier: LCSC; Contact Current: 50mA; Voltage Rating (DC): 12V; Circuit: 单刀单掷; Mounting Style: 立贴; Actuator Style: 圆形按钮; Actuator/Cap Color: 黑色; Mechanical Life: 80000; Pin Style: 鸥翼型; Switch Length: 6mm; Switch Width: 6mm; Switch Height: 5mm; Strike Gundam: 否
U2 U3 U10 U16 = 74HCT125D,653: 逻辑电路的归属系列:74HCT;逻辑类型:缓冲器，非反向;元件数:4;每元件位数:1;; Supplier Part: C5962; Manufacturer: Nexperia(安世); Supplier Footprint: SOIC-14_150mil; JLCPCB Part Class: Extended Part; Datasheet: https://atta.szlcsc.com/upload/public/pdf/source/20170914/C5962_1505374133819969204.pdf; Supplier: LCSC; Series: 74HCT; Logic Type: 缓冲器，非反向; Number of Elements: 4; Number of Bits per Element: 1; Output Type: 三态; Current - Output High, Low: 6mA、6mA; Voltage - Supply: 4.5V ~ 5.5V; Operating Temperature: -40~+125（TA）
U4 U12 U17 U20 = HEF4093BT,653: GATE NAND 4CH 2-INP; Supplier Part: C7867; Manufacturer: Nexperia(安世); Supplier Footprint: SOIC-14_150mil; JLCPCB Part Class: Extended Part; Datasheet: https://atta.szlcsc.com/upload/public/pdf/source/20170523/1495534038073.pdf; Supplier: LCSC
U5-U9 U15 = 74HC194D,653: 逻辑电路的归属系列:-;逻辑类型:-;输出类型:-;元件数:-;每元件位数:-;; Supplier Part: C546685; Manufacturer: Nexperia(安世); Supplier Footprint: SO-16; JLCPCB Part Class: Extended Part; Datasheet: https://atta.szlcsc.com/upload/public/pdf/source/20200702/C546685_E911489C8C4E572945734C46AEB0ABAF.pdf; Supplier: LCSC
GND H3-H5 VCC = PZ254V-11-02P: 间距:2.54mm;总PIN位数:2;排数:1;插针结构:1x2P;行距:-;安装类型:直插;圆针/方针:方针;额定电流:-;额定电压:-;配合针长度:6mm;塑高:2.5mm;端接针长度:3mm;触头材质:黄铜;触头镀层:-;工作温度范围:-40~+105;颜色:黑色;; LCSC Part Name: 2.54mm 1x2P 直插 方针; Supplier Part: C492401; Manufacturer: XFCN(兴飞); Supplier Footprint: 插件,P=2.54mm; JLCPCB Part Class: Extended Part; Datasheet: https://atta.szlcsc.com/upload/public/pdf/source/20200309/C492401_A812433581A9B211A7FFA413ADDFF0E5.pdf; Supplier: LCSC; Pitch: 2.54mm; Number of Pins: 2; Number of Rows: 1; Pin Structure: 1x2P; Mounting Type: 直插; Circluar Pins/Square Pins: 方针; Length of Mating Pin: 6mm; Insulation Height: 2.5mm; Length of End Connection Pin: 3mm; Contact Material: 黄铜; Operating Temperature Range: -40~+105; Color: 黑色
RN1-RN4 = 4D03WGJ0103T5E: 阻值:10kΩ;单个元件功率:62.5mW;电阻器数:4;引脚数:8;; LCSC Part Name: 10kΩ ±5%; Supplier Part: C29718; Manufacturer: UNI-ROYAL(厚声); Supplier Footprint: 0603x4; JLCPCB Part Class: Basic Part; Datasheet: https://atta.szlcsc.com/upload/public/pdf/source/20170615/1497511005633.pdf; Supplier: LCSC; Power(Watts): 62.5mW; Number of Resistors: 4; Number of Pins: 8
U1 = XD74LS147: Supplier Part: C521198; Manufacturer: XINLUDA(信路达); Supplier Footprint: DIP-16; JLCPCB Part Class: Extended Part; Datasheet: https://atta.szlcsc.com/upload/public/pdf/source/20200424/C521197_44E3118D18892D99555CDE5C346394E2.pdf; Supplier: LCSC
LED1-LED4 = 19-217/BHC-ZL1M2RY/3T: 照明颜色:蓝色;主波长/色坐标:465~475nm;; LCSC Part Name: 0603 蓝灯; Supplier Part: C72041; Manufacturer: EVERLIGHT(台湾亿光); Supplier Footprint: 0603; JLCPCB Part Class: Basic Part; Datasheet: https://atta.szlcsc.com/upload/public/pdf/source/20170116/1484561237273.pdf; Supplier: LCSC; Mounting Type: 表面贴装; Illumination Color: 蓝色; Luminous Intensity (IF=20mA): 11.5~28.5mcd@5mA; Dominant Wavelength / Coordinate rank: 465~475nm
U11 = XD74LS85: 4 位幅度比较器; LCSC Part Name: 逻辑比较器; Supplier Part: C707100; Manufacturer: XINLUDA(信路达); Supplier Footprint: DIP-16; JLCPCB Part Class: Extended Part; Datasheet: https://atta.szlcsc.com/upload/public/pdf/source/20200724/C707100_38938E7BD2244E5D8EFD64240EBB087E.pdf; Supplier: LCSC
U13 U14 U18 U19 = SN74LS08DR: 逻辑电路的归属系列:74LS;逻辑类型:与门;电路/元件数:4;输入数/每元件位数:2;电源电压:4.75V ~ 5.25V;静态电流（最大值）:-;; Supplier Part: C6802; Manufacturer: TI(德州仪器); Supplier Footprint: SOIC-14_150mil; JLCPCB Part Class: Extended Part; Datasheet: https://atta.szlcsc.com/upload/public/pdf/source/20140711/1457707148299.pdf; Supplier: LCSC; Series: 74LS; Logic Type: 与门; Number of Circuits/Elements: 4; Number of Inputs/Bits per Element: 2; Supply Voltage（Single）: 4.75V ~ 5.25V; Current - Output High, Low: 400A、8mA; Operating Temperature: 0~+70; Max Propagation Delay @ V, Max CL: 20ns @ 5V，15pF
LED5-LED8 = 17-21SYGC/S530-E3/TR8: 发光颜色:普绿/黄绿;; LCSC Part Name: 普绿/黄绿LED，贴片; Supplier Part: C142303; Manufacturer: EVERLIGHT(台湾亿光); Supplier Footprint: 0805; JLCPCB Part Class: Extended Part; Datasheet: https://atta.szlcsc.com/upload/public/pdf/source/20171110/C142303_15102792667121104246.pdf; Supplier: LCSC; Emitted Color: 普绿/黄绿

## Nets
GND: GND.1 GND.2 LED1.2(C) LED2.2(C) LED3.2(C) LED4.2(C) LED5.1(K) LED6.1(K) LED7.1(K) LED8.1(K) LED9.1(K) LED10.2(C) R2.1 R3.1 SW3.4 SW6.4 SW9.4 SW10.1 SW10.4 SW11.1 SW11.4 U1.8(GND) U2.7(GND) U3.7(GND) U4.7(VSS) U5.8(GND) U6.8(GND) U7.8(GND) U8.8(GND) U9.8(GND) U9.10(S1) U10.7(GND) U11.8(GND) U12.7(VSS) U13.7(GND) U14.7(GND) U15.8(GND) U15.10(S1) U16.7(GND) U17.7(VSS) U18.7(GND) U19.7(GND) U20.7(VSS)
VCC: R1.2 RN1.5 RN1.6 RN1.7 RN1.8 RN2.5 RN2.6 RN2.7 RN2.8 RN3.5 RN3.6 RN3.7 RN3.8 RN4.5 RN4.6 RN4.7 RN4.8 SW10.3 SW10.6 SW12.1 SW12.2 U1.16(VCC) U2.14(VCC) U3.14(VCC) U4.14(VDD) U5.1(MR#) U5.9(S0) U5.10(S1) U5.16(VCC) U6.1(MR#) U6.9(S0) U6.10(S1) U6.16(VCC) U7.1(MR#) U7.9(S0) U7.10(S1) U7.16(VCC) U8.1(MR#) U8.9(S0) U8.10(S1) U8.16(VCC) U9.9(S0) U9.16(VCC) U10.14(VCC) U11.2(IA<B) U11.3(IA=B) U11.4(IA>B) U11.16(VCC) U12.14(VDD) U13.14(VCC) U14.14(VCC) U15.2(DSR) U15.9(S0) U15.16(VCC) U16.9(3A) U16.14(VCC) U17.14(VDD) U18.14(VCC) U19.14(VCC) U20.14(VDD) VCC.1 VCC.2
A0: U3.3(1Y) U5.3(D0) U10.3(1Y)
A1: U3.6(2Y) U5.4(D1) U10.6(2Y)
A2: U3.8(3Y) U5.5(D2) U10.8(3Y)
A3: U3.11(4Y) U5.6(D3) U10.11(4Y)
ALLINPUT: U13.9(3A) U14.11(4Y) U17.1(1A) U17.2(1B)
B0: U2.3(1Y) U11.9(B0) U19.1(1A)
B1: U2.6(2Y) U11.11(B1) U19.2(1B)
B2: U2.8(3Y) U11.14(B2) U19.4(2A)
B3: U2.11(4Y) U11.1(B3) U19.5(2B)
C0: U8.15(Q0) U10.2(1A) U11.10(A0)
C1: U8.14(Q1) U10.5(2A) U11.12(A1)
C2: U8.13(Q2) U10.9(3A) U11.13(A2)
C3: U8.12(Q3) U10.12(4A) U11.15(A3)
CLK0: U5.11(CP) U6.11(CP) U7.11(CP) U8.11(CP) U20.3(1Y)
CLK1: H3.1 H3.2 U9.11(CP) U15.11(CP) U20.4(2Y)
D0: LED4.1(A) U9.15(Q0) U13.1(1A)
D1: LED3.1(A) U9.14(Q1) U13.2(1B)
D2: LED2.1(A) U9.13(Q2) U13.4(2A)
D3: LED1.1(A) U9.12(Q3) U13.5(2B)
FALSE: H4.1 H4.2 LED9.2(A) U16.6(2Y)
K0: RN4.1 U1.9(A) U2.2(1A) U3.2(1A) U18.1(1A)
K1: RN4.2 U1.7(B) U2.5(2A) U3.5(2A) U18.2(1B)
K2: RN4.3 U1.6(C) U2.9(3A) U3.9(3A) U18.4(2A)
K3: RN4.4 U1.14(D) U2.12(4A) U3.12(4A) U18.5(2B)
MODE: SW10.5 U2.1(1OE#) U2.4(2OE#) U2.10(3OE#) U2.13(4OE#) U4.1(1A) U4.2(1B) U10.1(1OE#) U10.4(2OE#) U10.10(3OE#) U10.13(4OE#) U12.1(1A) U12.2(1B)
NOTCLR: R3.2 U12.6(2B) U15.1(MR#) U16.8(3Y)
TRUE: H5.1 H5.2 LED10.1(A) U16.3(1Y)
UNLOCK: U13.8(3Y) U16.2(1A) U17.5(2A) U17.6(2B)
$1N1872: SW7.4 SW8.3
$1N1875: SW8.4 SW9.3
$1N1878: SW4.4 SW5.3
$1N1881: SW5.4 SW6.3
$1N1887: SW1.4 SW2.3
$1N1890: SW2.4 SW3.3
$1N1956: RN2.1 SW1.1 U1.11(1)
$1N1965: RN2.2 SW2.1 U1.12(2)
$1N1975: RN2.3 SW3.1 U1.13(3)
$1N1985: RN2.4 SW4.1 U1.1(4)
$1N1996: RN3.1 SW5.1 U1.2(5)
$1N2008: RN3.2 SW6.1 U1.3(6)
$1N2020: RN3.3 SW7.1 U1.4(7)
$1N2030: RN3.4 SW8.1 U1.5(8)
$1N2056: RN1.4 SW9.1 U1.10(9)
$2N2771: U3.1(1OE#) U3.4(2OE#) U3.10(3OE#) U3.13(4OE#) U4.3(1Y)
$3N1562: U5.15(Q0) U6.3(D0)
$3N1565: U5.14(Q1) U6.4(D1)
$3N1568: U5.13(Q2) U6.5(D2)
$3N1571: U5.12(Q3) U6.6(D3)
$3N1574: U6.15(Q0) U7.3(D0)
$3N1577: U6.14(Q1) U7.4(D1)
$3N1580: U6.13(Q2) U7.5(D2)
$3N1583: U6.12(Q3) U7.6(D3)
$3N1597: U7.15(Q0) U8.3(D0)
$3N1600: U7.14(Q1) U8.4(D1)
$3N1603: U7.13(Q2) U8.5(D2)
$3N1609: U7.12(Q3) U8.6(D3)
$4N3077: U9.2(DSR) U11.6(OA=B)
$4N4880: U12.3(1Y) U12.5(2A)
$4N5315: U12.4(2Y) U12.8(3A) U12.9(3B)
$4N5466: U9.1(MR#) U12.10(3Y)
$5N1823: U13.3(1Y) U13.13(4B)
$5N1838: U13.6(2Y) U13.12(4A)
$5N1853: U13.10(3B) U13.11(4Y)
$5N2125: LED8.2(A) U14.1(1A) U15.15(Q0)
$5N2142: LED7.2(A) U14.2(1B) U15.14(Q1)
$5N2159: LED6.2(A) U14.4(2A) U15.13(Q2)
$5N2176: LED5.2(A) U14.5(2B) U15.12(Q3)
$5N2687: U14.3(1Y) U14.13(4B)
$5N2728: U14.6(2Y) U14.12(4A)
$6N1903: R1.1 SW11.5 U16.1(1OE#) U16.4(2OE#)
$6N2046: U16.13(4OE#) U17.3(1Y)
$6N2223: U16.5(2A) U17.4(2Y)
$6N2582: R2.2 U16.10(3OE#) U16.11(4Y)
$6N3192: SW12.4 U16.12(4A)
$7N1243: U18.3(1Y) U18.13(4B)
$7N1250: U18.6(2Y) U18.12(4A)
$7N1259: U18.11(4Y) U20.1(1A) U20.2(1B)
$7N1385: U19.3(1Y) U19.13(4B)
$7N1394: U19.6(2Y) U19.12(4A)
$7N1403: U19.11(4Y) U20.5(2A) U20.6(2B)

Not connected (* = marked no-connect by the designer): RN1 1 2 3; SW1 2 3; SW2 2; SW3 2; SW4 2 3; SW5 2; SW6 2; SW7 2 3; SW8 2; SW9 2; SW10 2; SW11 2 3 6; SW12 3; U1 15(NC); U4 4(2Y) 5(2A) 6(2B) 8(3A) 9(3B) 10(3Y) 11(4Y) 12(4A) 13(4B); U5 2(DSR) 7(DSL); U6 2(DSR) 7(DSL); U7 2(DSR) 7(DSL); U8 2(DSR) 7(DSL); U9 3(D0) 4(D1) 5(D2) 6(D3) 7(DSL); U11 5(OA>B) 7(OA<B); U12 11(4Y) 12(4A) 13(4B); U14 8(3Y) 9(3A) 10(3B); U15 3(D0) 4(D1) 5(D2) 6(D3) 7(DSL); U17 8(3A) 9(3B) 10(3Y) 11(4Y) 12(4A) 13(4B); U18 8(3Y) 9(3A) 10(3B); U19 8(3Y) 9(3A) 10(3B); U20 8(3A) 9(3B) 10(3Y) 11(4Y) 12(4A) 13(4B)

# Board PCB1
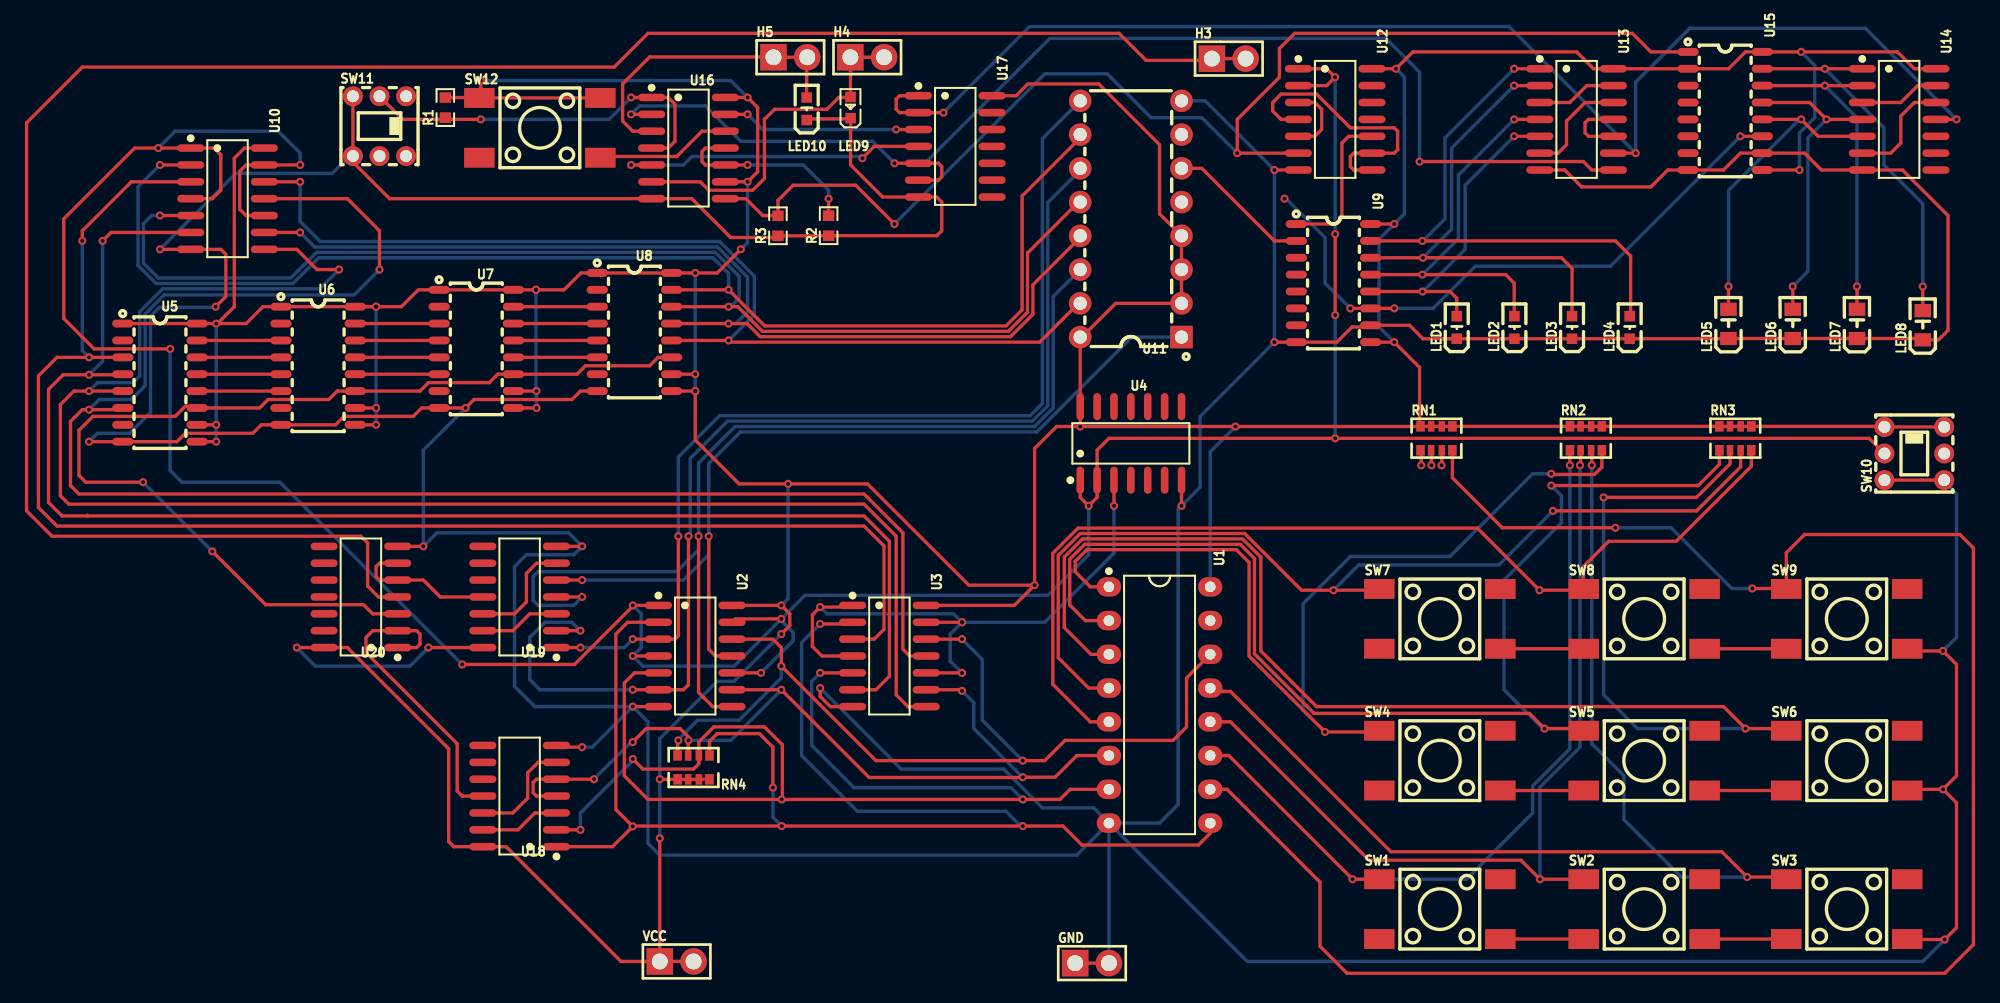
[diagram p8: board, top side]
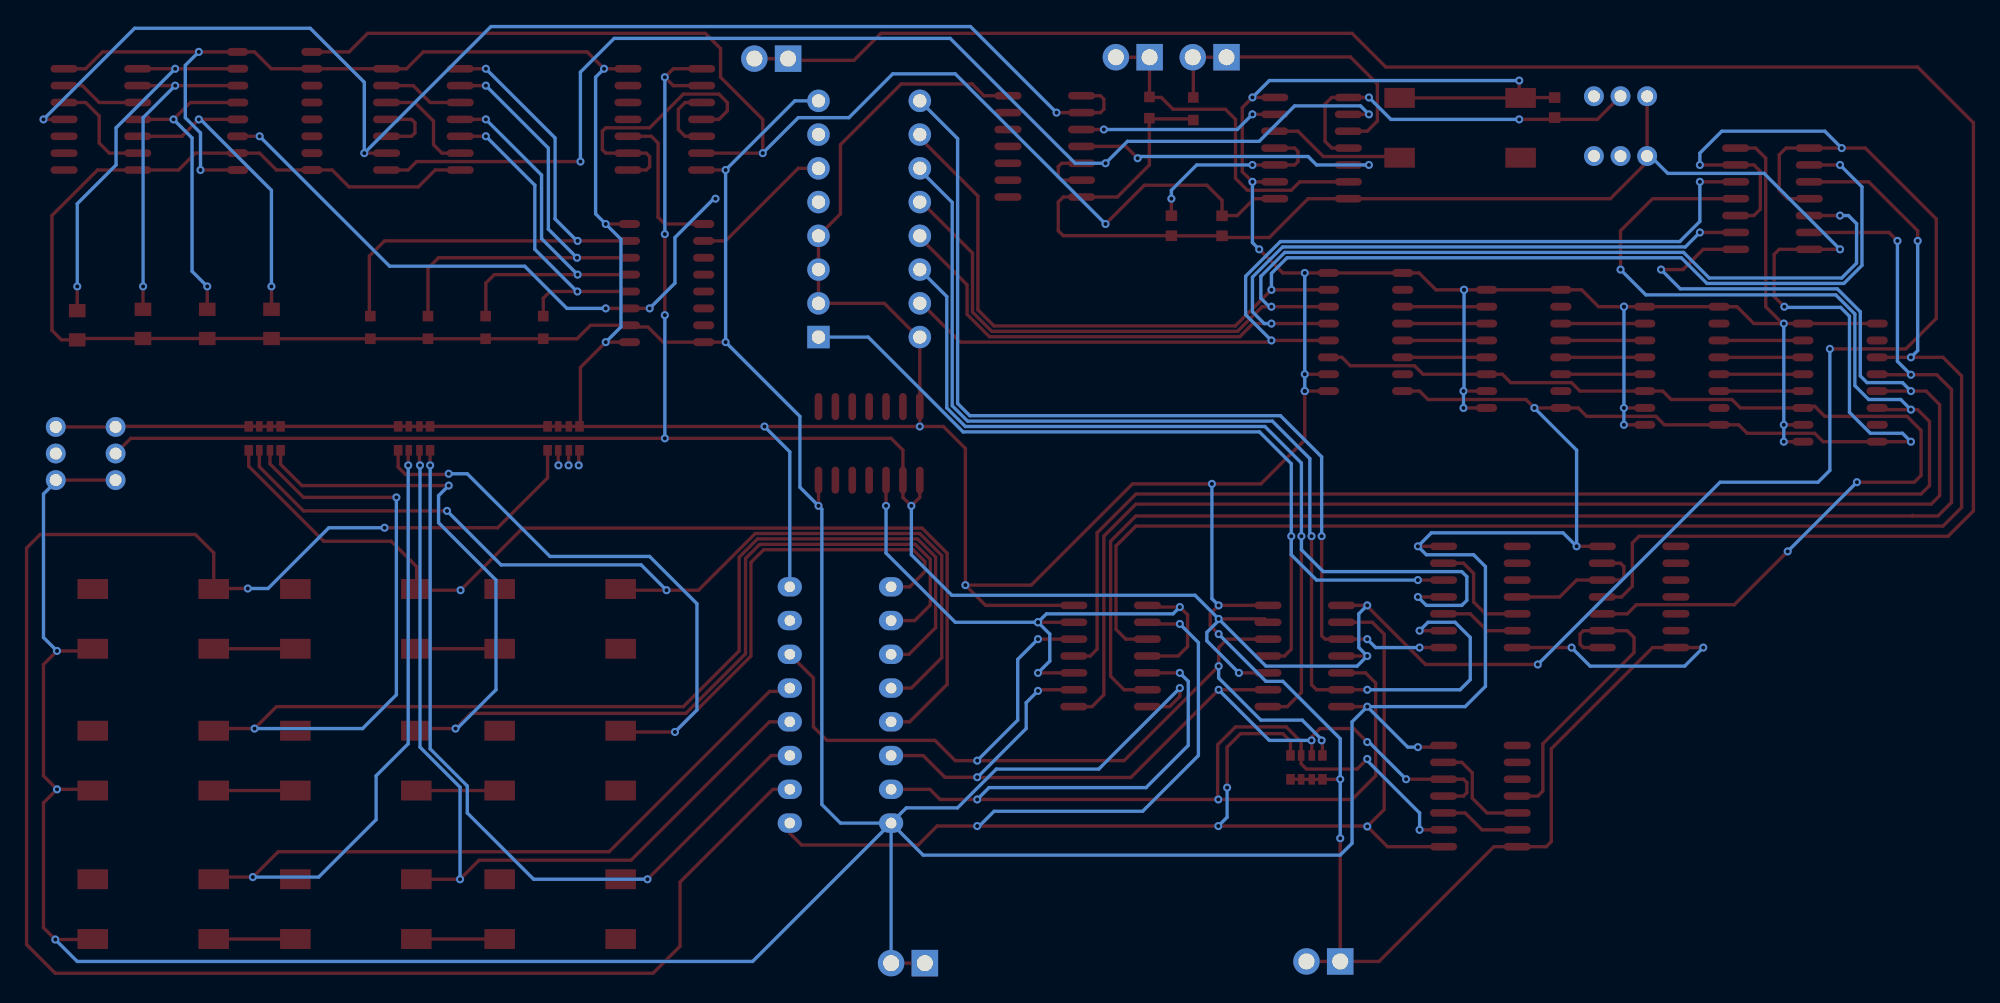
[diagram p9: board, bottom side, seen from below]

No outline. copper layers: Top Layer, Bottom Layer. Coordinates in mm from the lowest, leftmost part position.
Stack: Top Layer 0.035mm / Dielectric1 1.51mm FR4 er 4.5 / Bottom Layer 0.035mm

## Design rules (mm)
spacing safeClearance (default): track to track 0.152, other pairs 0.152 to 0.3
track width trackWidth (default): min 0.127, default 0.254, max 2.54
differential pair differentialPair (default): width min 0.127, default 0.254, max 2.54; gap min 0.152, default 0.152
via viaSize (default): diameter min 0.5, default 0.61, max 10; hole min 0.3, default 0.305, max 6

## Placement (name value [footprint] x y rotation side)
GND  PZ254V-11-02P  [HDR-TH_2P-P2.54-V-M]  70.1 0 0 top
H3  PZ254V-11-02P  [HDR-TH_2P-P2.54-V-M]  80.39 68.07 0 top
H4  PZ254V-11-02P  [HDR-TH_2P-P2.54-V-M]  53.2 68.18 0 top
H5  PZ254V-11-02P  [HDR-TH_2P-P2.54-V-M]  47.41 68.18 0 top
LED1  19-217/BHC-ZL1M2RY/3T  [LED0603-R-RD_BLUE]  97.54 47.84 90 top
LED2  19-217/BHC-ZL1M2RY/3T  [LED0603-R-RD_BLUE]  101.87 47.84 90 top
LED3  19-217/BHC-ZL1M2RY/3T  [LED0603-R-RD_BLUE]  106.21 47.84 90 top
LED4  19-217/BHC-ZL1M2RY/3T  [LED0603-R-RD_BLUE]  110.54 47.84 90 top
LED5  17-21SYGC/S530-E3/TR8  [LED0805-RD]  117.98 48.11 90 top
LED6  17-21SYGC/S530-E3/TR8  [LED0805-RD]  122.81 48.11 90 top
LED7  17-21SYGC/S530-E3/TR8  [LED0805-RD]  127.64 48.11 90 top
LED8  17-21SYGC/S530-E3/TR8  [LED0805-RD]  132.59 48.01 90 top
LED9  NCD0603R1  [LED0603-RD_RED]  51.94 64.39 90 top
LED10  19-217/GHC-YR1S2/3T  [LED0603-R-RD]  48.64 64.3 90 top
R1  10kΩ  [R0603]  21.46 64.39 90 top
R2  10kΩ  [R0603]  50.29 55.5 90 top
R3  10kΩ  [R0603]  46.48 55.49 90 top
RN1  10kΩ  [RES-ARRAY-SMD_0603-8P-L3.2-W1.6-BL]  96.01 39.5 0 top
RN2  10kΩ  [RES-ARRAY-SMD_0603-8P-L3.2-W1.6-BL]  107.25 39.5 0 top
RN3  10kΩ  [RES-ARRAY-SMD_0603-8P-L3.2-W1.6-BL]  118.49 39.5 0 top
RN4  10kΩ  [RES-ARRAY-SMD_0603-8P-L3.2-W1.6-BL]  40.13 14.73 180 top
SW1  KH-6X6X5H-STM  [SW-SMD_4P-L6.0-W6.0-P4.50-LS9.0-2]  96.27 4.06 0 top
SW2  KH-6X6X5H-STM  [SW-SMD_4P-L6.0-W6.0-P4.50-LS9.0-2]  111.63 4.06 0 top
SW3  KH-6X6X5H-STM  [SW-SMD_4P-L6.0-W6.0-P4.50-LS9.0-2]  126.87 4.06 0 top
SW4  KH-6X6X5H-STM  [SW-SMD_4P-L6.0-W6.0-P4.50-LS9.0-2]  96.27 15.24 0 top
SW5  KH-6X6X5H-STM  [SW-SMD_4P-L6.0-W6.0-P4.50-LS9.0-2]  111.63 15.24 0 top
SW6  KH-6X6X5H-STM  [SW-SMD_4P-L6.0-W6.0-P4.50-LS9.0-2]  126.87 15.24 0 top
SW7  KH-6X6X5H-STM  [SW-SMD_4P-L6.0-W6.0-P4.50-LS9.0-2]  96.27 25.91 0 top
SW8  KH-6X6X5H-STM  [SW-SMD_4P-L6.0-W6.0-P4.50-LS9.0-2]  111.63 25.91 0 top
SW9  KH-6X6X5H-STM  [SW-SMD_4P-L6.0-W6.0-P4.50-LS9.0-2]  126.87 25.91 0 top
SW10  PS-5850A-6PL  [SW-TH_6P-L5.8-W5.8-P2.00-LS4.5-BL]  131.95 38.35 90 top
SW11  PS-5850A-6PL  [SW-TH_6P-L5.8-W5.8-P2.00-LS4.5-BL]  16.51 62.99 0 top
SW12  KH-6X6X5H-STM  [SW-SMD_4P-L6.0-W6.0-P4.50-LS9.0-2]  28.57 62.87 0 top
U1  XD74LS147  [DIP-16_L19.2-W6.6-P2.54-LS7.6-BL]  75.18 19.43 270 top
U2  74HCT125D,653  [SOIC-14_L8.7-W3.9-P1.27-LS6.0-BL]  40.26 23.11 270 top
U3  74HCT125D,653  [SOIC-14_L8.7-W3.9-P1.27-LS6.0-BL]  54.86 23.11 270 top
U4  HEF4093BT,653  [SOIC-14_L8.7-W3.9-P1.27-LS6.0-BL]  73.03 39.12 0 top
U5  74HC194D,653  [SO-16_L9.9-W3.9-P1.27-LS6.0-BL]  0 43.69 270 top
U6  74HC194D,653  [SO-16_L9.9-W3.9-P1.27-LS6.0-BL]  11.9 44.96 270 top
U7  74HC194D,653  [SO-16_L9.9-W3.9-P1.27-LS6.0-BL]  23.79 46.23 270 top
U8  74HC194D,653  [SO-16_L9.9-W3.9-P1.27-LS6.0-BL]  35.69 47.5 270 top
U9  74HC194D,653  [SO-16_L9.9-W3.9-P1.27-LS6.0-BL]  88.27 51.18 270 top
U10  74HCT125D,653  [SOIC-14_L8.7-W3.9-P1.27-LS6.0-BL]  5.08 57.53 270 top
U11  XD74LS85  [PDIP-16_L19.2-W6.6-P2.54-LS7.62-BL]  73.03 56.01 90 top
U12  HEF4093BT,653  [SOIC-14_L8.7-W3.9-P1.27-LS6.0-BL]  88.39 63.5 270 top
U13  SN74LS08DR  [SOIC-14_L8.7-W3.9-P1.27-LS6.0-BL]  106.55 63.5 270 top
U14  SN74LS08DR  [SOIC-14_L8.7-W3.9-P1.27-LS6.0-BL]  130.81 63.5 270 top
U15  74HC194D,653  [SO-16_L9.9-W3.9-P1.27-LS6.0-BL]  117.73 64.14 270 top
U16  74HCT125D,653  [SOIC-14_L8.7-W3.9-P1.27-LS6.0-BL]  39.75 61.34 270 top
U17  HEF4093BT,653  [SOIC-14_L8.7-W3.9-P1.27-LS6.0-BL]  59.82 61.47 270 top
U18  SN74LS08DR  [SOIC-14_L8.7-W3.9-P1.27-LS6.0-BL]  27.05 12.57 90 top
U19  SN74LS08DR  [SOIC-14_L8.7-W3.9-P1.27-LS6.0-BL]  27.05 27.56 90 top
U20  HEF4093BT,653  [SOIC-14_L8.7-W3.9-P1.27-LS6.0-BL]  15.11 27.56 90 top
VCC  PZ254V-11-02P  [HDR-TH_2P-P2.54-V-M]  38.86 0.13 0 top

## Footprints (pads in the part's own frame, mm; a bottom-side part is the same pattern mirrored in y, then rotated)
DIP-16_L19.2-W6.6-P2.54-LS7.6-BL
  oval 1.46x1.827 hole 0.8: 1(-8.89,-3.81) 2(-6.35,-3.81) 3(-3.81,-3.81) 4(-1.27,-3.81) 5(1.27,-3.81) 6(3.81,-3.81) 7(6.35,-3.81) 8(8.89,-3.81) 9(8.89,3.81) 10(6.35,3.81) 11(3.81,3.81) 12(1.27,3.81) 13(-1.27,3.81) 14(-3.81,3.81) 15(-6.35,3.81) 16(-8.89,3.81)
HDR-TH_2P-P2.54-V-M
  rect 2x2 hole 1.2: 1(-1.27,0)
  round 2 hole 1.2: 2(1.27,0)
LED0603-R-RD
  rect 0.8x0.8 smd: 1(0.851,0) 2(-0.851,0)
LED0603-R-RD_BLUE
  rect 0.8x0.8 smd: 1(0.851,0) 2(-0.851,0)
LED0603-RD_RED
  rect 0.8x0.8 smd: 1(-0.799,-0.004) 2(0.799,0.004)
LED0805-RD
  rect 1x1.25 smd: 1(-1.1,0) 2(1.1,0)
PDIP-16_L19.2-W6.6-P2.54-LS7.62-BL
  rect 1.7x1.7 hole 1.001: 1(-8.89,-3.81)
  round 1.7 hole 1.001: 2(-6.35,-3.81) 3(-3.81,-3.81) 4(-1.27,-3.81) 5(1.27,-3.81) 6(3.81,-3.81) 7(6.35,-3.81) 8(8.89,-3.81) 9(8.89,3.81) 10(6.35,3.81) 11(3.81,3.81) 12(1.27,3.81) 13(-1.27,3.81) 14(-3.81,3.81) 15(-6.35,3.81) 16(-8.89,3.81)
R0603
  rect 0.806x0.864 smd: 1(-0.753,0) 2(0.753,0)
RES-ARRAY-SMD_0603-8P-L3.2-W1.6-BL
  rect 0.65x0.8 smd: 1(-1.2,-0.9) 4(1.2,-0.9) 5(1.2,0.9) 8(-1.2,0.9)
  rect 0.5x0.8 smd: 2(-0.4,-0.9) 3(0.4,-0.9) 6(0.4,0.9) 7(-0.4,0.9)
SO-16_L9.9-W3.9-P1.27-LS6.0-BL
  oval 0.6x1.6 smd: 1(-4.445,-2.794) 2(-3.175,-2.794) 3(-1.905,-2.794) 4(-0.635,-2.794) 5(0.635,-2.794) 6(1.905,-2.794) 7(3.175,-2.794) 8(4.445,-2.794) 9(4.445,2.794) 10(3.175,2.794) 11(1.905,2.794) 12(0.635,2.794) 13(-0.635,2.794) 14(-1.905,2.794) 15(-3.175,2.794) 16(-4.445,2.794)
SOIC-14_L8.7-W3.9-P1.27-LS6.0-BL
  oval 0.574x2.038 smd: 1(-3.81,-2.769) 2(-2.54,-2.769) 3(-1.27,-2.769) 4(0,-2.769) 5(1.27,-2.769) 6(2.54,-2.769) 7(3.81,-2.769) 8(3.81,2.769) 9(2.54,2.769) 10(1.27,2.769) 11(0,2.769) 12(-1.27,2.769) 13(-2.54,2.769) 14(-3.81,2.769)
SW-SMD_4P-L6.0-W6.0-P4.50-LS9.0-2
  rect 2.3x1.5 smd: 1(-4.55,2.25) 2(4.55,2.25) 3(-4.55,-2.25) 4(4.55,-2.25)
SW-TH_6P-L5.8-W5.8-P2.00-LS4.5-BL
  round 1.5 hole 0.9: 1(-2,-2.25) 2(0,-2.25) 3(2,-2.25) 4(-2,2.25) 5(0,2.25) 6(2,2.25)

## Nets
As in the schematic, except:
K2: RN4.3 U1.6 U2.9 U3.9 U18.4 U18.5
K3: RN4.4 U1.14 U2.12 U3.12

Pads without a net: RN1 1 2 3; SW1 2 3; SW2 2; SW3 2; SW4 2 3; SW5 2; SW6 2; SW7 2 3; SW8 2; SW9 2; SW10 2; SW11 2 3 6; SW12 3; U1 15; U4 4 5 6 8 9 10 11 12 13; U5 2 7; U6 2 7; U7 2 7; U8 2 7; U9 3 4 5 6 7; U11 5 7; U12 11 12 13; U14 8 9 10; U15 3 4 5 6 7; U17 8 9 10 11 12 13; U18 8 9 10; U19 8 9 10; U20 8 9 10 11 12 13

## Via types
v1: diameter 0.61, hole 0.305, Top Layer to Bottom Layer, 171 vias

## Routing (per net, layer and track width the routed paths; a pad name or vN(x,y) marks a point on that pad's centre or on a via; arc(x,y) is an arc through that point)
GND: length 585.7
  Top Layer w0.254: U20.7 v1(19.81,31.37) ; GND.1 71.37,0 ; 117.83,46.86 117.98,47.01 132.48,47.01 LED8.1 133.77,46.91 134.49,47.62 134.49,56.26 131.06,59.69 U14.7 124.97,59.69 123.7,60.96 U15.10 118.87,60.96 117.6,59.69 U15.8 113.41,59.69 112.14,58.42 106.93,58.42 105.66,59.69 U13.7 ; v1(35.56,19.3) U2.7 ; v1(134.11,13.08) 131.51,13.08 SW6.4 ; v1(134.11,13.08) 135.13,14.1 135.13,22.48 v1(134.11,23.5) 131.59,23.5 SW9.4 ; v1(134.11,13.08) 135.13,12.06 135.13,2.67 v1(134.24,1.78) 131.46,1.78 SW3.4 ; 48.77,63.54 51.9,63.54 LED9.1 51.95,60.07 54.36,57.66 U17.7 58.42,57.66 58.8,57.28 58.8,55.12 58.43,54.75 R2.1 50.28,54.74 R3.1 46.35,54.61 42.93,54.61 40,57.53 U16.7 17.27,57.53 14.51,60.29 SW11.1 SW11.4 ; 32.89,43.05 31.62,43.05 30.99,42.42 23.62,42.42 v1(22.99,41.78) U7.8 19.69,41.78 19.05,41.15 13.84,41.15 13.21,40.51 U6.8 7.62,40.51 6.99,39.88 1.91,39.88 1.27,39.24 U5.8 v1(-5.33,39.24) ; v1(83.82,46.74) U9.8 88.52,46.74 89.66,47.88 90.93,47.88 U9.10 93.98,48.01 95,46.99 97.54,46.99 ; v1(4.19,49.4) 4.95,50.17 4.95,53.34 4.57,53.72 U10.7 v1(0,53.72) ; LED1.2 LED2.2 LED3.2 LED4.2 117.83,46.99 ; U18.7 29.95,16.26 v1(31.75,16.26) ; SW10.1 SW10.4 ; v1(49.66,20.7) 49.66,20.07 50.42,19.3 U3.7 ; U4.7 76.84,34.54 ; v1(83.82,59.69) U12.7 ; U19.7 v1(31.75,31.37)
  Bottom Layer w0.254: 49.78,20.57 55.75,14.61 63.46,14.61 66.38,11.68 70.23,11.68 U1.8 ; 71.37,0 U1.8 ; U1.8 81.79,0.13 132.59,0.13 134.13,1.67 ; U1.8 75.18,10.54 76.58,11.94 76.58,34.16 v1(76.84,34.42) ; U1.8 68.96,8.13 37.59,8.13 36.7,9.02 36.7,18.16 v1(35.56,19.3) ; v1(-5.33,39.24) -4.7,39.88 -2.29,39.88 -0.71,41.45 -0.71,48.69 -0.04,49.35 4.14,49.35 v1(4.19,49.4) ; v1(31.75,16.26) 32.51,16.26 v1(35.56,19.3) ; v1(22.99,41.78) 19.81,38.61 v1(19.81,31.37) 20.83,32.39 30.73,32.39 v1(31.75,31.37) 31.12,30.73 27.56,30.73 26.67,29.84 26.67,20.83 28.19,19.3 v1(35.56,19.3) ; v1(76.84,34.42) 78.23,35.81 78.23,41.15 v1(83.82,46.74) v1(83.82,59.69) 78.61,64.9 U11.8 ; v1(76.84,34.42) 76.84,34.54 ; SW10.1 134.2,36.23 135.13,35.31 135.13,24.51 v1(134.11,23.5) ; SW11.1 14.26,60.74 12.95,59.44 5.72,59.44 v1(0,53.72)
VCC: length 536.4
  Top Layer w0.254: SW12.1 24.13,65.22 v1(24.13,66.42) ; SW12.1 SW12.2 ; SW12.1 24,65.14 R1.2 ; v1(37.59,9.4) 37.59,0.13 ; 37.59,0.13 VCC.2 ; 37.59,0.13 34.67,0.13 26.03,8.76 U18.14 22.1,8.76 21.72,9.14 21.72,16.13 14.1,23.75 U20.14 v1(10.29,23.75) ; U16.9 v1(44.2,58.8) 44.96,59.56 44.96,64.39 v1(44.2,65.15) U16.14 ; U14.14 131.95,67.31 130.68,68.58 v1(123.44,68.58) U15.16 119.25,68.58 117.98,67.31 115.7,67.31 115.57,67.44 ; U12.14 v1(92.96,67.31) 94.23,68.58 106.55,68.58 107.82,67.31 U13.14 115.57,67.31 ; 4.32,48.13 6.48,48.13 7.75,49.4 v1(16.25,49.4) 18.16,49.4 19.43,50.67 U7.1 U7.16 v1(28.28,50.67) 30.39,50.67 31.66,51.94 U8.1 U8.16 v1(40.26,51.94) 41.91,51.94 v1(43.69,53.72) ; 4.32,48.13 v1(4.23,48.13) U5.16 U5.1 ; 4.32,48.13 5.59,49.4 5.59,60.58 6.35,61.34 U10.14 ; v1(65.79,28.45) 64.26,26.92 U3.14 ; v1(65.79,28.45) 65.79,38.74 67.44,40.39 v1(69.22,40.39) ; v1(65.79,28.45) 60.83,28.45 53.21,36.07 v1(47.24,36.07) 43.56,36.07 40.26,39.37 v1(40.26,43.05) 38.48,43.05 ; 92.71,55.63 U9.16 ; 121.29,59.69 v1(123.32,59.69) ; U5.9 4.19,39.24 ; v1(40.26,44.32) U8.10 ; v1(20.19,23.75) U19.14 ; v1(37.59,13.84) 37.6,13.83 RN4.5 RN4.6 RN4.7 40.54,13.84 41.32,13.84 RN4.8 ; v1(46.74,24.77) 47.37,25.4 47.37,26.29 v1(46.74,26.92) U2.14 ; v1(69.22,40.39) v1(80.9,40.39) 94.8,40.39 RN1.8 ; v1(69.22,40.39) U4.14 U11.16 69.34,47.12 71.88,49.66 U11.2 U11.3 U11.4 75.18,56.39 75.18,61.6 70.61,66.17 65.28,66.17 64.39,65.28 U17.14 ; RN1.8 94.74,40.47 94.74,44.83 v1(92.84,46.74) U9.9 ; RN1.8 RN1.7 RN1.6 RN1.5 RN2.8 RN2.7 RN2.6 RN2.5 RN3.8 RN3.7 RN3.6 RN3.5 129.66,40.4 SW10.6 SW10.3 ; v1(28.32,43.05) U7.10 ; v1(16.26,40.51) U6.9 ; 4.19,40.51 U5.10 ; v1(28.32,41.78) U7.9 ; v1(16.26,41.78) 14.69,41.78
  Bottom Layer w0.254: v1(44.2,58.8) 44.2,54.23 v1(43.69,53.72) ; v1(92.96,67.31) 93.6,66.68 93.6,56.39 v1(92.84,55.63) 91.69,54.48 91.69,47.88 v1(92.84,46.74) ; v1(47.24,36.07) 47.24,27.43 v1(46.74,26.92) ; v1(16.25,49.4) 16.25,41.79 v1(16.26,41.78) v1(16.26,40.51) ; v1(37.59,9.4) v1(37.59,13.84) 37.59,16.89 41.91,21.21 43.18,21.21 v1(46.74,24.77) ; v1(80.9,40.39) 78.99,38.48 78.99,28.32 ; v1(40.26,43.05) v1(40.26,44.32) v1(40.26,51.94) ; v1(4.23,39.24) v1(4.23,40.51) v1(4.23,48.13) ; v1(24.13,66.42) 42.93,66.42 v1(44.2,65.15) ; v1(123.44,68.58) 124.46,67.56 124.46,63.63 123.32,62.48 v1(123.32,59.69) ; v1(28.28,50.67) 28.28,43.09 v1(28.32,43.05) v1(28.32,41.78) ; v1(20.19,23.75) 18.8,22.35 11.68,22.35 v1(10.29,23.75)
(no net): length 3.8
  Top Layer w0.254: RN1.3 96.41,37.64 ; 96.41,37.64 96.39,37.62 ; 96.41,37.64 96.41,37.36 ; 94.87,37.34 94.87,38.54 RN1.1 ; 95.63,37.34 95.63,38.58 RN1.2
  vias: v1(94.87,37.47) v1(95.63,37.47) v1(96.39,37.47)
A0: length 110
  Top Layer w0.254: U3.3 53.72,24.38 54.46,25.12 54.46,31.39 52.96,32.89 -7.75,32.89 -9.14,34.29 -9.14,44.2 -7.75,45.59 v1(-5.33,45.59) U5.3 ; U10.3 -2.16,58.8 -5.84,55.12 v1(-5.84,54.36)
  Bottom Layer w0.254: v1(-5.33,45.59) -5.84,46.1 v1(-5.84,54.36)
A1: length 109.8
  Top Layer w0.254: U5.4 -2.84,44.28 v1(-5.33,44.28) -7.28,44.28 -8.38,43.18 -8.38,34.67 -7.37,33.66 -5.5,33.66 -5.45,33.7 -5.41,33.66 52.96,33.66 54.86,31.75 54.86,21.59 53.85,20.57 U3.6 ; v1(-4.32,54.36) -3.68,54.99 U10.6
  Bottom Layer w0.254: v1(-4.32,54.36) -4.32,45.3 v1(-5.33,44.28)
A2: length 122.3
  Top Layer w0.254: U3.8 56.26,19.3 55.37,20.19 55.37,32.13 52.96,34.54 -6.86,34.54 -7.49,35.18 -7.49,42.04 -6.48,43.05 v1(-5.33,43.05) -2.79,43.05 ; v1(13.46,52.2) 11.81,52.2 10.29,53.72 U10.8
  Bottom Layer w0.254: v1(-5.33,43.05) -4.7,43.69 -2.03,43.69 -1.52,44.2 -1.52,49.02 0.2,50.75 12.01,50.75 v1(13.46,52.2)
A3: length 125.9
  Top Layer w0.254: U10.11 14.1,57.53 16.51,55.12 v1(16.51,52.2) ; U5.6 -2.92,41.66 v1(-5.33,41.66) -5.84,41.66 -6.73,40.77 -6.73,35.94 -6.1,35.31 52.96,35.31 55.88,32.39 55.88,23.62 56.39,23.11 U3.11
  Bottom Layer w0.254: v1(-5.33,41.66) -4.57,42.42 -2.16,42.42 -1.12,43.46 -1.12,48.85 0.32,50.29 14.6,50.29 v1(16.51,52.2)
ALLINPUT: length 102.1
  Top Layer w0.254: U17.1 55.63,65.28 55.37,65.02 55.37,64.26 55.63,64.01 U17.2 v1(58.93,64.01) ; U14.11 v1(135.13,63.5) ; v1(111,60.96) U13.9
  Bottom Layer w0.254: v1(58.93,64.01) 65.41,70.48 101.47,70.48 v1(111,60.96) 111,66.29 115.06,70.36 128.27,70.36 v1(135.13,63.5)
B0: length 76
  Top Layer w0.254: v1(35.56,24.38) U2.3 38.74,24.38 38.99,24.64 v1(38.99,32.13) ; v1(31.62,23.75) U19.1
  Bottom Layer w0.254: v1(38.99,32.13) 38.99,38.1 42.09,41.2 65.45,41.2 66.37,42.12 66.37,62.05 U11.9 ; v1(35.56,24.38) 34.93,23.75 v1(31.62,23.75)
B1: length 86.4
  Top Layer w0.254: v1(31.62,25.02) U19.2 ; v1(39.75,32.13) 39.75,20.96 39.37,20.57 U2.6 v1(35.56,20.57)
  Bottom Layer w0.254: v1(35.56,20.57) 28.57,20.57 27.81,21.34 27.81,24.51 28.96,25.65 30.99,25.65 v1(31.62,25.02) ; v1(39.75,32.13) 39.88,32.26 39.88,37.97 42.7,40.79 65.62,40.79 66.78,41.95 66.78,57.25 69.22,59.69 U11.11
B2: length 82
  Top Layer w0.254: v1(31.75,27.56) U19.4 ; U2.8 41.58,19.3 40.51,20.37 v1(40.51,32.13)
  Bottom Layer w0.254: U11.14 67.18,50.17 67.18,41.78 65.79,40.39 43.26,40.39 40.51,37.64 v1(40.51,32.13) 40.51,31.12 38.86,29.46 28.45,29.46 28.07,29.08 28.07,27.31 28.45,26.92 31.12,26.92 v1(31.75,27.56)
B3: length 69.1
  Top Layer w0.254: U2.11 41.78,23.11 41.28,23.62 v1(41.28,32.13) ; v1(31.75,28.83) U19.5
  Bottom Layer w0.254: U11.1 73.09,47.12 65.95,39.98 43.66,39.98 41.28,37.59 v1(41.28,32.13) 41.28,30.73 39.37,28.83 v1(31.75,28.83)
C0: length 101.1
  Top Layer w0.254: v1(0,60.07) 2.29,60.07 2.3,60.08 U10.2 ; U11.10 69.22,62.1 64.85,57.73 64.85,49.17 63.64,47.96 45.49,47.96 v1(42.77,50.67) 38.48,50.67
  Bottom Layer w0.254: v1(42.77,50.67) 42.77,51.91 41.59,53.09 11.94,53.09 10.01,51.16 -0.3,51.16 -1.65,52.51 -1.65,58.42 v1(0,60.07)
C1: length 94.4
  Top Layer w0.254: U11.12 69.09,57.28 65.25,53.44 65.25,49 63.81,47.55 45.32,47.55 43.46,49.4 v1(42.77,49.4) U8.14 ; v1(0,56.26) U10.5
  Bottom Layer w0.254: v1(0,56.26) -0.63,56.26 -1.24,55.65 -1.24,52.68 -0.13,51.56 9.84,51.56 11.77,53.49 41.76,53.49 43.56,51.69 43.56,50.04 42.93,49.4 v1(42.77,49.4)
C2: length 77.8
  Top Layer w0.254: U8.13 v1(42.77,48.13) 44.16,48.13 45.15,47.14 63.97,47.14 65.66,48.83 65.66,51.05 69.22,54.61 U11.13 ; v1(10.54,54.99) U10.9
  Bottom Layer w0.254: v1(42.77,48.13) 43.31,48.13 44.2,49.02 44.2,51.63 41.93,53.9 11.63,53.9 v1(10.54,54.99)
C3: length 79.2
  Top Layer w0.254: U11.15 69.09,49.66 66.17,46.74 42.89,46.74 v1(42.77,46.86) U8.12 ; v1(10.54,58.8) U10.12
  Bottom Layer w0.254: v1(42.77,46.86) 44.7,48.8 44.7,51.7 42.09,54.31 12.05,54.31 10.54,55.82 v1(10.54,58.8)
CLK0: length 78.6
  Top Layer w0.254: U8.11 37.47,45.59 36.83,44.96 32,44.96 31.37,44.32 U7.11 25.4,44.32 24.77,43.69 20.19,43.69 19.56,43.05 U6.11 13.34,43.05 12.7,42.42 8.13,42.42 7.49,41.78 U5.11 2.67,41.91 1.91,41.91 1.14,41.15 -5.04,41.15 -6.1,40.1 -6.1,36.7 -5.59,36.19 v1(-1.27,36.19) ; U20.3 16,26.29 15.32,26.97 7.95,26.97 v1(3.94,30.99)
  Bottom Layer w0.254: v1(3.94,30.99) v1(-1.27,36.19)
CLK1: length 203.8
  Top Layer w0.254: v1(89.53,49.28) U9.11 v1(92.84,49.28) ; v1(118.87,62.23) U15.11 ; H3.2 H3.1 78.99,67.95 74.17,67.95 72.14,69.98 36.7,69.98 34.16,67.44 -5.84,67.44 -10.03,63.25 -10.03,34.04 -8.13,32.13 15.11,32.13 15.62,31.62 15.62,28.37 16.43,27.56 U20.4
  Bottom Layer w0.254: v1(84.58,57.53) 84.71,57.53 87.63,54.61 87.63,51.18 v1(89.53,49.28) ; v1(118.87,62.23) 109.09,52.45 98.93,52.45 95.76,49.28 v1(92.84,49.28)
D0: length 42.4
  Top Layer w0.254: U9.15 v1(94.95,54.36) 109.47,54.36 110.62,53.21 110.62,48.77 110.54,48.69 ; U13.1 v1(101.85,67.31)
  Bottom Layer w0.254: v1(101.85,67.31) 96.65,62.1 96.65,56.01 95,54.36 v1(94.95,54.36)
D1: length 36.8
  Top Layer w0.254: U13.2 v1(101.85,66.04) ; 106.21,48.69 106.21,52.29 105.41,53.09 v1(95,53.09) U9.14
  Bottom Layer w0.254: v1(101.85,66.04) 97.16,61.34 97.16,55.24 v1(95,53.09)
D2: length 30
  Top Layer w0.254: U13.4 v1(101.85,63.5) ; U9.13 v1(94.95,51.82) 101.22,51.82 101.85,51.18 101.85,48.71 101.87,48.69
  Bottom Layer w0.254: v1(101.85,63.5) 97.66,59.31 97.66,54.53 v1(94.95,51.82)
D3: length 24.5
  Top Layer w0.254: U9.12 v1(94.97,50.55) 97.03,50.55 97.54,50.04 LED1.1 ; U13.5 v1(101.85,62.23)
  Bottom Layer w0.254: v1(94.97,50.55) 95,50.55 98.17,53.72 98.17,58.55 v1(101.85,62.23)
FALSE: length 26.3
  Top Layer w0.254: H4.2 H4.1 51.94,68.17 LED9.2 51.9,65.15 51.05,65.15 50.16,64.26 46.23,64.26 45.47,63.5 45.47,59.06 44.58,58.17 41.28,58.17 40.64,58.8 U16.6
K0: length 114.8
  Top Layer w0.254: U3.2 51.97,25.53 v1(49.66,25.53) ; 29.69,8.76 34.04,8.76 v1(35.56,10.29) ; v1(35.56,10.29) 34.29,11.56 34.29,24.77 35.18,25.65 U2.2 ; v1(35.56,10.29) 35.59,10.32 v1(46.76,10.32) v1(64.9,10.32) 67.91,10.32 69.34,8.89 78.1,8.89 78.99,9.78 U1.9 ; v1(46.1,13.21) 46.1,16.26 45.09,17.27 41.91,17.27 41.33,16.69 RN4.1
  Bottom Layer w0.254: v1(46.1,13.21) 46.1,10.98 v1(46.76,10.32) ; v1(49.66,25.53) 48.26,24.13 48.26,15.62 52.45,11.43 63.63,11.43 64.74,10.32 v1(64.9,10.32)
K1: length 100.5
  Top Layer w0.254: 49.78,21.84 U3.5 ; v1(35.56,15.37) 36.32,14.61 40.13,14.61 40.53,15 RN4.2 40.53,16.66 41.66,17.78 45.47,17.78 46.81,16.43 46.81,12.37 v1(46.76,12.32) ; v1(46.76,12.32) 36.7,12.32 34.93,14.1 34.93,21.08 35.69,21.84 U2.5 ; v1(46.76,12.32) v1(64.9,12.32) 67.69,12.32 68.45,13.08 U1.7 ; v1(31.62,10.03) U18.2
  Bottom Layer w0.254: 49.78,21.97 49.02,21.21 49.02,16.38 52.2,13.21 64.01,13.21 v1(64.9,12.32) ; v1(35.56,15.37) 35.56,15.24 31.62,11.3 v1(31.62,10.03)
  vias: v1(49.66,21.84)
K2: length 69.1
  Top Layer w0.254: U2.9 v1(46.74,20.57) 53.34,13.97 64.88,13.97 v1(64.9,13.99) 67.33,13.99 68.96,15.62 U1.6 ; v1(60.32,20.49) 60.24,20.57 U3.9 ; RN4.3 39.73,16.75 v1(39.75,16.76) 39.75,17.02 39.12,17.65 36.58,17.65 v1(35.56,16.64) ; U18.4 28.32,12.57 28.07,12.83 28.07,13.59 28.32,13.84 U18.5 v1(32.64,13.84)
  Bottom Layer w0.254: v1(32.64,13.84) 35.43,16.64 v1(35.56,16.64) ; v1(46.74,20.57) 42.93,16.76 v1(39.75,16.76) ; v1(60.32,20.49) 61.21,19.6 61.21,17.65 64.88,13.99 v1(64.9,13.99)
K3: length 71.5
  Top Layer w0.254: v1(38.99,16.76) 38.93,16.71 RN4.4 ; U1.14 77.22,21.46 77.22,17.78 76.2,16.76 68.07,16.76 66.55,15.24 v1(64.9,15.24) 53.85,15.24 v1(46.74,22.35) 46.74,23.75 46.1,24.38 U2.12 ; U3.12 v1(60.32,24.38)
  Bottom Layer w0.254: v1(38.99,16.76) 38.99,16.83 40.45,18.29 43.56,18.29 46.74,21.46 v1(46.74,22.35) ; v1(64.9,15.24) 61.85,18.29 61.85,22.86 v1(60.32,24.38)
MODE: length 271.5
  Top Layer w0.254: U2.13 43.28,25.91 v1(46.74,25.91) ; U10.4 3.94,57.53 4.57,58.17 4.57,60.83 4.06,61.34 U10.1 v1(-0.13,61.34) -1.91,61.34 -7.24,56.01 -7.24,48.51 -4.95,46.23 v1(0.76,46.23) ; U10.10 6.48,56.26 5.99,56.74 5.99,59.59 6.48,60.07 U10.13 v1(10.54,60.07) ; v1(88.39,54.86) v1(88.39,48.77) ; U12.2 87.76,66.04 v1(88.39,66.68) 87.76,67.31 U12.1 ; v1(22.73,22.48) 31.18,22.48 35.56,26.86 v1(35.56,26.92) U2.1 ; U4.1 69.22,35.05 v1(69.85,34.42) 70.49,35.05 U4.2 70.49,38.61 71.37,39.5 v1(88.39,39.5) 128.56,39.5 SW10.5 ; v1(35.56,23.11) U2.4 ; U2.10 v1(45.21,21.84)
  Bottom Layer w0.254: v1(88.39,48.77) v1(88.39,39.5) ; v1(0.76,46.23) 0.76,37.08 1.65,36.19 9.02,36.19 v1(22.73,22.48) ; v1(88.39,66.68) v1(88.39,54.86) ; v1(35.56,26.92) 36.19,26.29 36.19,23.75 v1(35.56,23.11) 36.32,22.35 43.18,22.35 v1(46.74,25.91) ; v1(-0.13,61.34) 1.14,62.61 8.89,62.61 10.54,60.96 v1(10.54,60.07) ; v1(45.21,21.84) 47.62,24.26 47.62,24.89 46.74,25.78 v1(46.74,25.91) ; v1(46.74,25.91) 48.51,27.69 66.8,27.69 69.85,30.73 v1(69.85,34.42)
NOTCLR: length 94.6
  Top Layer w0.254: U12.6 v1(81.03,60.96) 81.03,63.5 84.2,66.68 84.2,68.83 85.34,69.98 110.74,69.98 112.14,68.58 U15.1 ; v1(55.25,55.63) 52.32,58.55 47.62,58.55 46.48,57.4 R3.2 46.46,56.26 45.34,56.26 44.07,57.53 U16.8
  Bottom Layer w0.254: v1(55.25,55.63) 66.55,66.93 71.25,66.93 74.55,63.63 78.36,63.63 v1(81.03,60.96)
TRUE: length 23.1
  Top Layer w0.254: LED10.1 48.64,68.13 H5.2 H5.1 46.12,68.2 36.83,68.2 34.8,66.17 34.8,63.37 35.56,62.61 U16.3
UNLOCK: length 95.7
  Top Layer w0.254: 36.98,63.88 v1(35.43,63.88) ; U13.8 107.7,59.69 107.06,60.33 v1(94.74,60.33) ; v1(55.25,60.2) U17.5 58.55,60.2 58.8,59.94 58.8,59.18 58.55,58.93 U17.6
  Bottom Layer w0.254: v1(94.74,60.33) 94.74,67.06 92.2,69.6 66.93,69.6 57.53,60.2 v1(55.25,60.2) 53.59,61.85 43.69,61.85 41.02,64.52 36.07,64.52 v1(35.43,63.88)
$1N1872: length 6.3
  Top Layer w0.254: SW7.4 SW8.3
$1N1875: length 6.1
  Top Layer w0.254: SW8.4 SW9.3
$1N1878: length 6.3
  Top Layer w0.254: SW4.4 SW5.3
$1N1881: length 6.1
  Top Layer w0.254: SW5.4 SW6.3
$1N1887: length 6.3
  Top Layer w0.254: SW1.4 SW2.3
$1N1890: length 6.1
  Top Layer w0.254: SW2.4 SW3.3
$1N1956: length 60.7
  Top Layer w0.254: 106.05,37.64 106.05,37.47 ; 106.05,37.64 106.05,37.64 ; 106.05,37.64 RN2.1 ; U1.11 80.39,15.62 v1(89.7,6.31) SW1.1
  Bottom Layer w0.254: v1(106.05,37.47) 106.05,16.13 103.25,13.34 103.25,11.3 98.26,6.31 v1(89.7,6.31)
$1N1965: length 66.5
  Top Layer w0.254: 106.85,37.64 106.85,37.51 ; 106.85,37.64 106.81,37.6 ; 106.85,37.64 RN2.2 ; SW2.1 v1(103.8,6.31) 102.36,7.75 90.93,7.75 80.52,18.16 U1.12
  Bottom Layer w0.254: v1(106.81,37.47) 106.81,16.26 103.8,13.24 v1(103.8,6.31)
$1N1975: length 89.2
  Top Layer w0.254: 78.99,20.7 79.25,20.45 80.52,20.45 92.58,8.38 117.48,8.38 v1(119.38,6.48) 122.16,6.48 SW3.1 ; RN2.3 107.7,38.55 v1(107.7,37.47)
  Bottom Layer w0.254: v1(107.7,37.47) 107.7,16.51 110.11,14.1 110.11,10.8 114.43,6.48 v1(119.38,6.48)
$1N1985: length 75.2
  Top Layer w0.254: v1(104.65,36.83) 104.7,36.78 107.9,36.78 108.45,37.33 RN2.4 ; 71.37,28.32 69.98,28.32 68.83,29.46 68.83,30.23 69.72,31.12 80.96,31.12 81.91,30.16 81.91,23.11 v1(87.63,17.4) 91.62,17.4 SW4.1
  Bottom Layer w0.254: v1(104.65,36.83) 103.25,36.83 97.03,30.61 89.53,30.61 85.98,27.05 85.98,19.05 v1(87.63,17.4)
$1N1996: length 92.1
  Top Layer w0.254: RN3.1 117.29,37.53 115.7,35.94 v1(104.65,35.94) ; U1.2 69.6,25.78 68.43,26.95 68.43,30.39 69.55,31.52 81.13,31.52 81.15,31.5 81.27,31.5 82.32,30.45 82.32,23.28 86.81,18.8 103,18.8 v1(104.14,17.65) 106.92,17.65 SW5.1
  Bottom Layer w0.254: v1(104.65,35.94) 105.41,35.18 105.41,33.15 101.09,28.83 101.09,20.57 104.01,17.65 v1(104.14,17.65)
$1N2008: length 112.6
  Top Layer w0.254: SW6.1 122.16,17.65 v1(119.25,17.65) 117.6,19.3 87,19.3 82.8,23.5 82.8,30.55 81.42,31.93 69.39,31.93 68.02,30.56 68.02,25.25 70.03,23.24 U1.3 ; v1(108.58,35.05) 115.57,35.05 118.09,37.57 RN3.2
  Bottom Layer w0.254: v1(119.25,17.65) 111.12,17.65 108.58,20.19 v1(108.58,35.05)
$1N2020: length 74.8
  Top Layer w0.254: v1(104.77,34.04) 115.57,34.04 118.89,37.36 RN3.3 ; 71.37,20.7 69.85,20.7 67.56,22.99 67.56,30.68 69.22,32.33 81.59,32.33 85.86,28.07 v1(88.27,28.07) 91.62,28.07 SW7.1
  Bottom Layer w0.254: v1(104.77,34.04) 100.71,29.97 90.17,29.97 v1(88.27,28.07)
$1N2030: length 76.6
  Top Layer w0.254: RN3.4 119.69,37.4 114.05,31.75 108.97,31.75 107.06,29.84 107.06,28.18 SW8.1 106.99,28.07 v1(103.76,28.07) 99.09,32.74 69.05,32.74 67.16,30.85 67.16,20.98 69.98,18.16 U1.5
$1N2056: length 145.5
  Top Layer w0.254: U1.10 80.26,13.08 87.25,6.1 87.25,1.27 89.28,-0.76 134.24,-0.76 136.4,1.4 136.4,31.24 135.38,32.26 123.7,32.26 122.32,30.88 122.32,28.19 ; 122.32,28.19 122.51,28.19 122.64,28.07 ; 122.32,28.19 SW9.1 ; 122.32,28.19 v1(119.76,28.19) ; RN1.4 97.21,36.52 100.96,32.77 v1(109.47,32.77)
  Bottom Layer w0.254: v1(109.47,32.77) 113.67,32.77 118.24,28.19 v1(119.76,28.19)
$2N2771: length 49.2
  Top Layer w0.254: U3.1 51.97,26.8 v1(49.66,26.8) 49.07,26.21 49.07,23.83 49.78,23.11 U3.4 ; U4.3 v1(71.75,34.42) ; U3.10 v1(60.32,21.84) ; v1(60.32,25.65) U3.13
  Bottom Layer w0.254: v1(49.66,26.8) 50.16,26.29 59.69,26.29 v1(60.32,25.65) ; v1(60.32,25.65) 66.55,25.65 71.75,30.86 v1(71.75,34.42) ; v1(60.32,25.65) 59.44,24.77 59.44,22.73 v1(60.32,21.84)
$3N1562: length 6.3
  Top Layer w0.254: U5.15 U6.3
$3N1565: length 6.3
  Top Layer w0.254: U5.14 U6.4
$3N1568: length 6.3
  Top Layer w0.254: U5.13 U6.5
$3N1571: length 6.3
  Top Layer w0.254: 2.79,43.05 U6.6
$3N1574: length 6.3
  Top Layer w0.254: U6.15 U7.3
$3N1577: length 6.3
  Top Layer w0.254: U6.14 U7.4
$3N1580: length 6.3
  Top Layer w0.254: U6.13 U7.5
$3N1583: length 6.3
  Top Layer w0.254: U6.12 U7.6
$3N1597: length 6.3
  Top Layer w0.254: U7.15 U8.3
$3N1600: length 6.3
  Top Layer w0.254: U7.14 U8.4
$3N1603: length 6.3
  Top Layer w0.254: U7.13 U8.5
$3N1609: length 6.3
  Top Layer w0.254: U7.12 U8.6
$4N3077: length 10.9
  Top Layer w0.254: U9.2 83.82,54.36 78.36,59.82 U11.6
$4N4880: length 5.5
  Top Layer w0.254: U12.5 86.87,62.23 87.38,62.74 87.38,64.26 86.87,64.77 U12.3
$4N5315: length 21.3
  Top Layer w0.254: U12.4 84.33,63.5 83.69,64.14 83.69,64.77 84.33,65.41 87,65.41 89.53,62.87 92.84,62.87 93.09,62.61 93.09,61.21 92.84,60.96 U12.9 89.79,60.96 89.53,60.71 89.53,59.94 89.79,59.69 U12.8
$4N5466: length 11.7
  Top Layer w0.254: U9.1 88.39,55.63 88.9,56.13 88.9,61.72 89.41,62.23 U12.10
$5N1823: length 6.1
  Top Layer w0.254: U13.3 106.05,64.77 107.31,66.04 U13.13
$5N1838: length 8.2
  Top Layer w0.254: U13.6 105.16,60.96 105.79,61.6 105.79,63.37 107.19,64.77 U13.12
$5N1853: length 5.2
  Top Layer w0.254: U13.10 107.44,62.23 107.19,62.48 107.19,63.25 107.44,63.5 U13.11
$5N2125: length 28
  Top Layer w0.254: U14.1 v1(125.22,67.31) 121.29,67.31 ; LED8.2 v1(132.59,50.93)
  Bottom Layer w0.254: v1(125.22,67.31) 129.67,62.87 129.67,60.07 132.59,57.15 v1(132.59,50.93)
$5N2142: length 24.6
  Top Layer w0.254: 121.29,66.04 v1(125.22,66.04) U14.2 ; LED7.2 127.64,50.92 v1(127.63,50.93)
  Bottom Layer w0.254: v1(125.22,66.04) 127.63,63.63 v1(127.63,50.93)
$5N2159: length 22.6
  Top Layer w0.254: 121.29,64.77 124.08,64.77 v1(125.35,63.5) U14.4 ; LED6.2 122.81,50.93
  Bottom Layer w0.254: v1(122.81,50.93) 123.95,52.07 123.95,62.1 v1(125.35,63.5)
$5N2176: length 23.9
  Top Layer w0.254: U14.5 124.71,62.23 v1(123.44,63.5) 121.29,63.5 ; LED5.2 117.98,50.92 v1(117.98,50.93)
  Bottom Layer w0.254: v1(117.98,50.93) 117.98,58.17 123.32,63.5 v1(123.44,63.5)
$5N2687: length 6.1
  Top Layer w0.254: U14.13 132.21,66.04 130.94,64.77 U14.3
$5N2728: length 8.3
  Top Layer w0.254: U14.6 130.18,60.96 130.94,61.72 130.94,63.75 131.95,64.77 U14.12
$6N1903: length 28.8
  Top Layer w0.254: v1(24.13,63.5) 21.33,63.5 ; 21.33,63.5 18.25,63.5 SW11.5 ; 21.33,63.5 R1.1 ; v1(35.43,65.15) U16.1 38.23,65.15 38.74,64.64 38.74,61.85 38.23,61.34 U16.4
  Bottom Layer w0.254: v1(24.13,63.5) 33.78,63.5 v1(35.43,65.15)
$6N2046: length 15
  Top Layer w0.254: v1(55.37,62.74) U17.3 ; 42.52,63.88 v1(44.2,63.88)
  Bottom Layer w0.254: v1(55.37,62.74) 45.34,62.74 v1(44.2,63.88)
$6N2223: length 23.8
  Top Layer w0.254: U17.4 53.72,61.47 v1(52.83,60.58) ; U16.5 v1(35.43,60.07)
  Bottom Layer w0.254: v1(52.83,60.58) 52.71,60.71 40,60.71 39.37,60.07 v1(35.43,60.07)
$6N2582: length 15
  Top Layer w0.254: v1(50.29,57.53) R2.2 ; U16.11 41.02,61.34 40.77,61.09 40.77,60.33 41.02,60.07 U16.10 v1(44.2,60.07)
  Bottom Layer w0.254: v1(44.2,60.07) 48.39,60.07 50.29,58.17 v1(50.29,57.53)
$6N3192: length 10.2
  Top Layer w0.254: U16.12 40.77,62.61 38.86,60.71 33.22,60.71 SW12.4
$7N1243: length 6.1
  Top Layer w0.254: 29.69,11.3 28.19,11.3 26.92,10.03 24.16,10.03
$7N1250: length 8.2
  Top Layer w0.254: 24.16,11.3 26.54,11.3 27.66,12.42 27.66,14.33 28.45,15.11 29.69,15.11
$7N1259: length 23.4
  Top Layer w0.254: U20.1 19.3,23.75 19.56,24 19.56,24.77 19.3,25.02 U20.2 16,25.02 15.49,24.51 15.49,23.37 22.35,16.51 22.35,12.95 22.73,12.57 U18.11
$7N1385: length 6.1
  Top Layer w0.254: U19.13 26.54,25.02 27.81,26.29 U19.3
$7N1394: length 8.4
  Top Layer w0.254: U19.12 26.67,26.29 27.56,27.18 27.56,29.34 28.32,30.1 29.82,30.1
$7N1403: length 11.2
  Top Layer w0.254: U20.5 19.81,28.83 21.08,27.56 U19.11 ; 18.01,30.1 16.51,30.1 16.26,29.84 16.26,29.08 16.51,28.83 17.75,28.83
